# EAGLE design undercarriage (EAGLE 9.6.2)
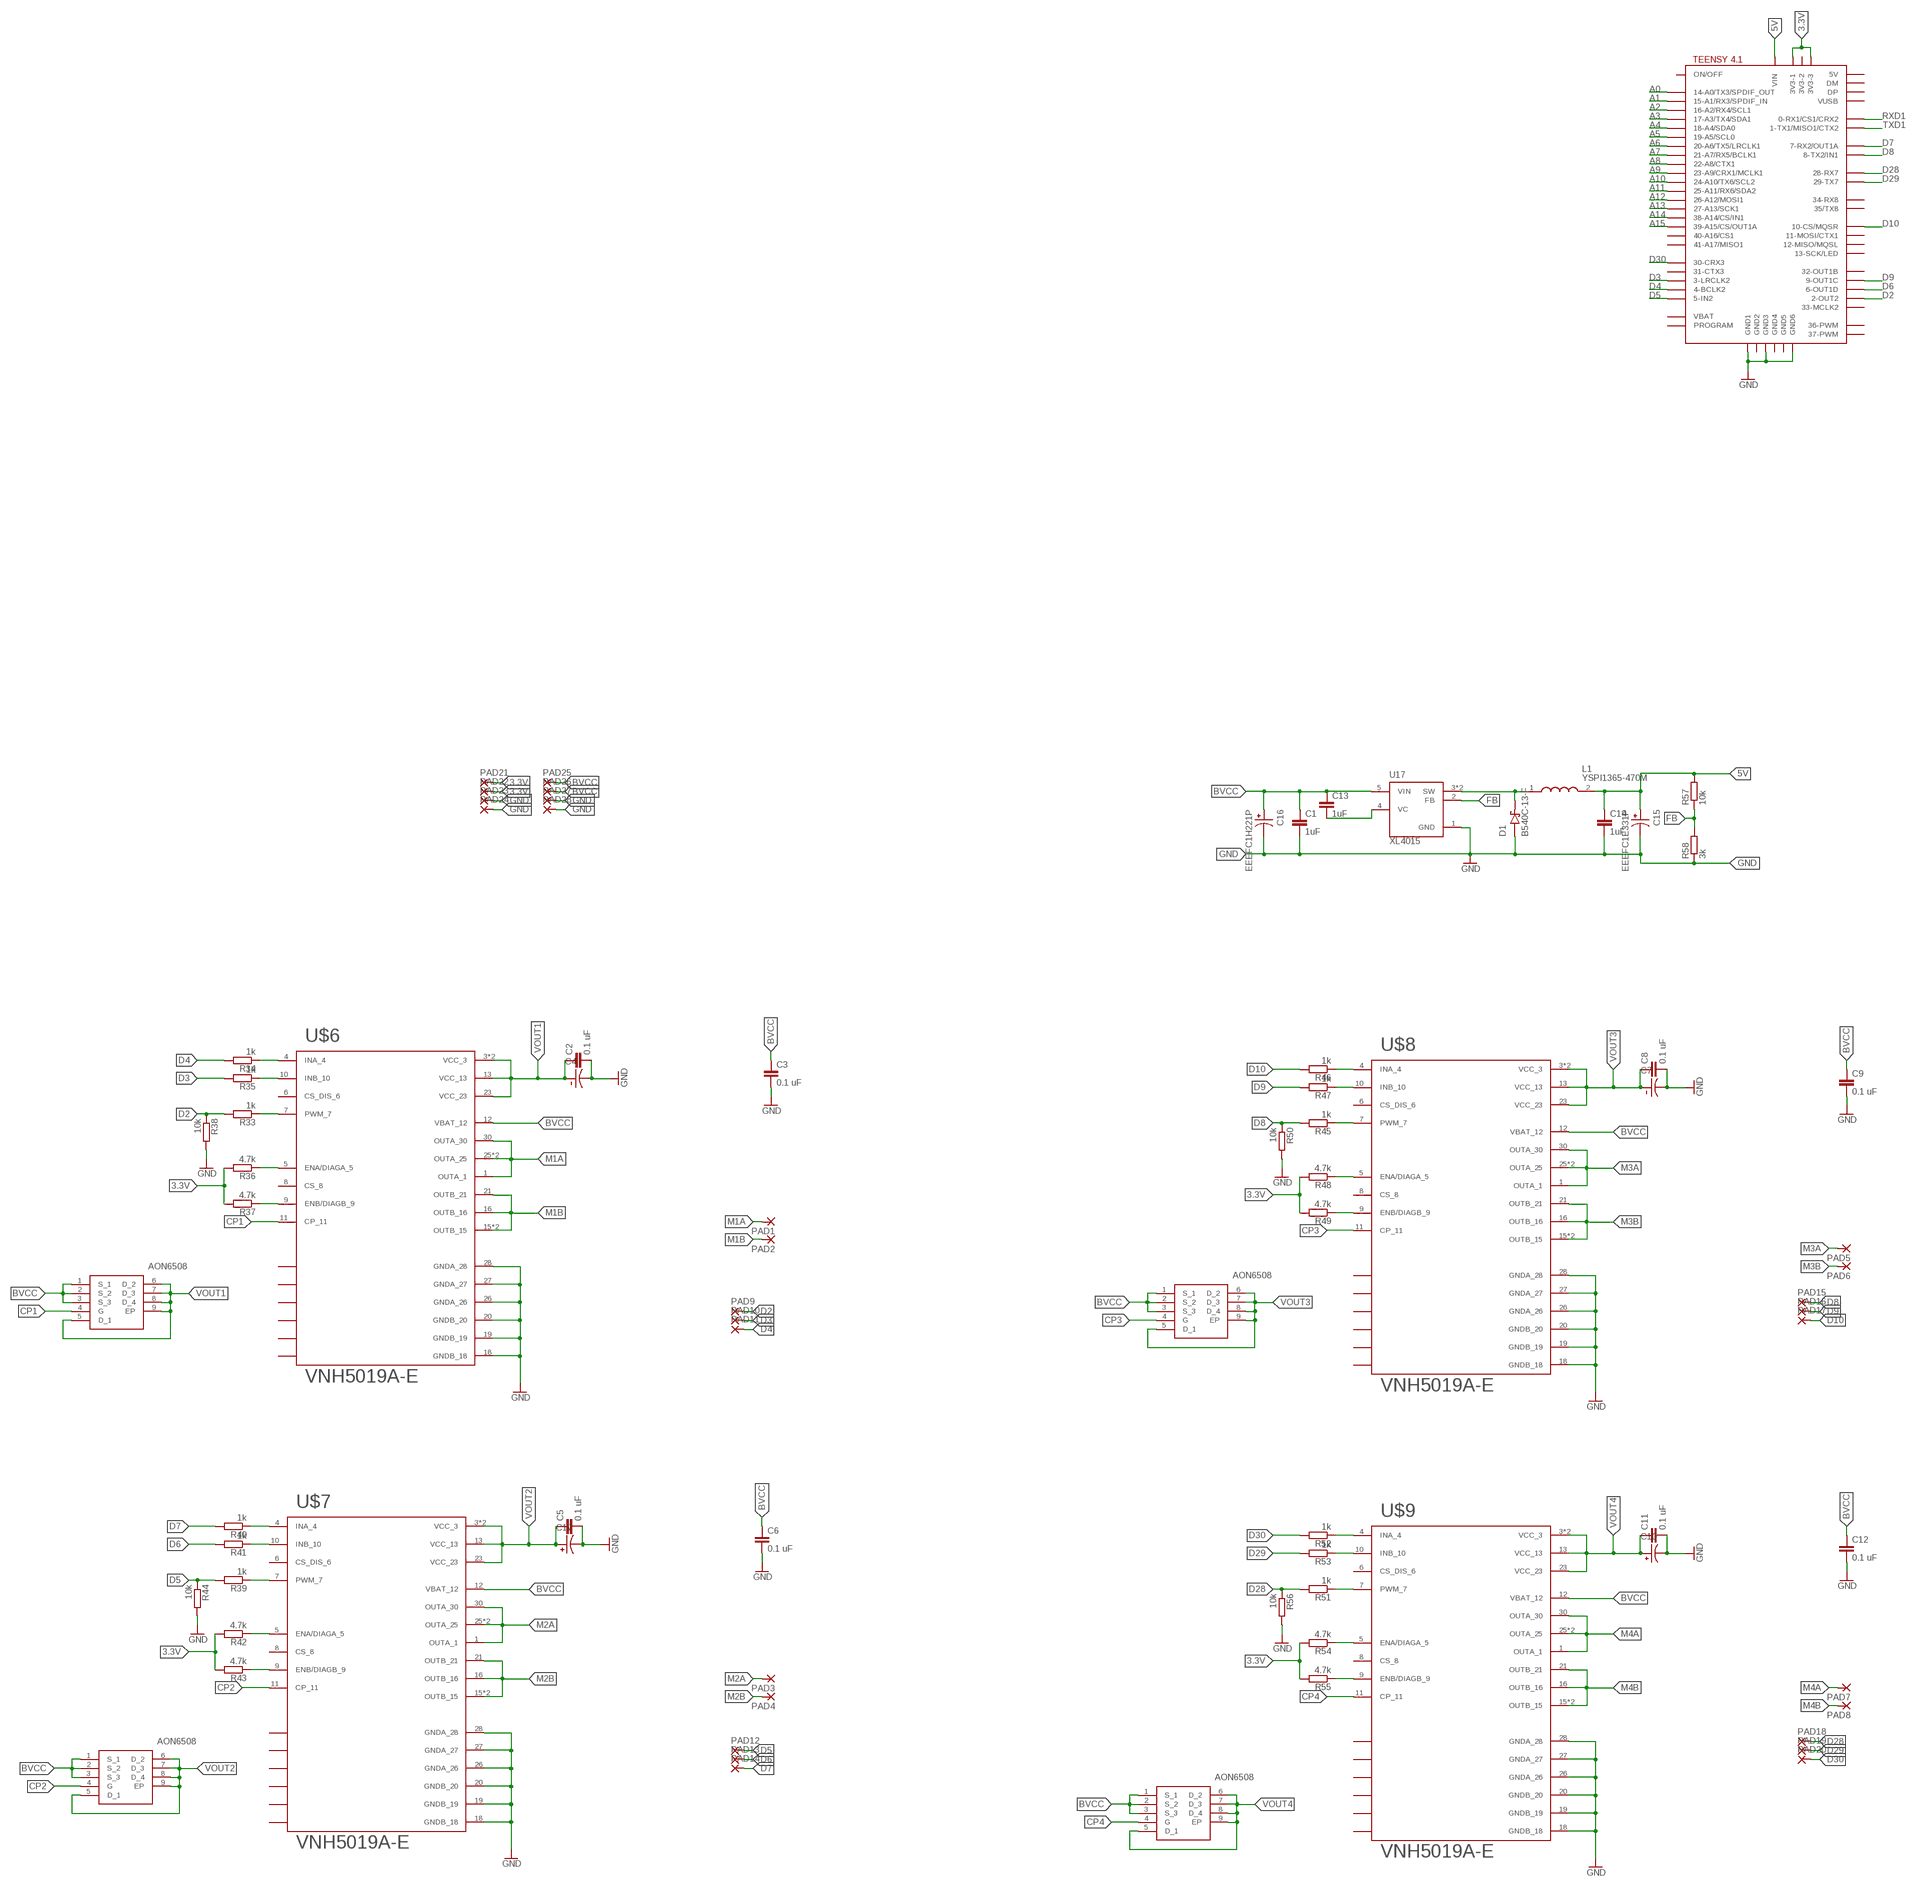
[diagram p0: schematic, sheet 1, part 1 of 2]
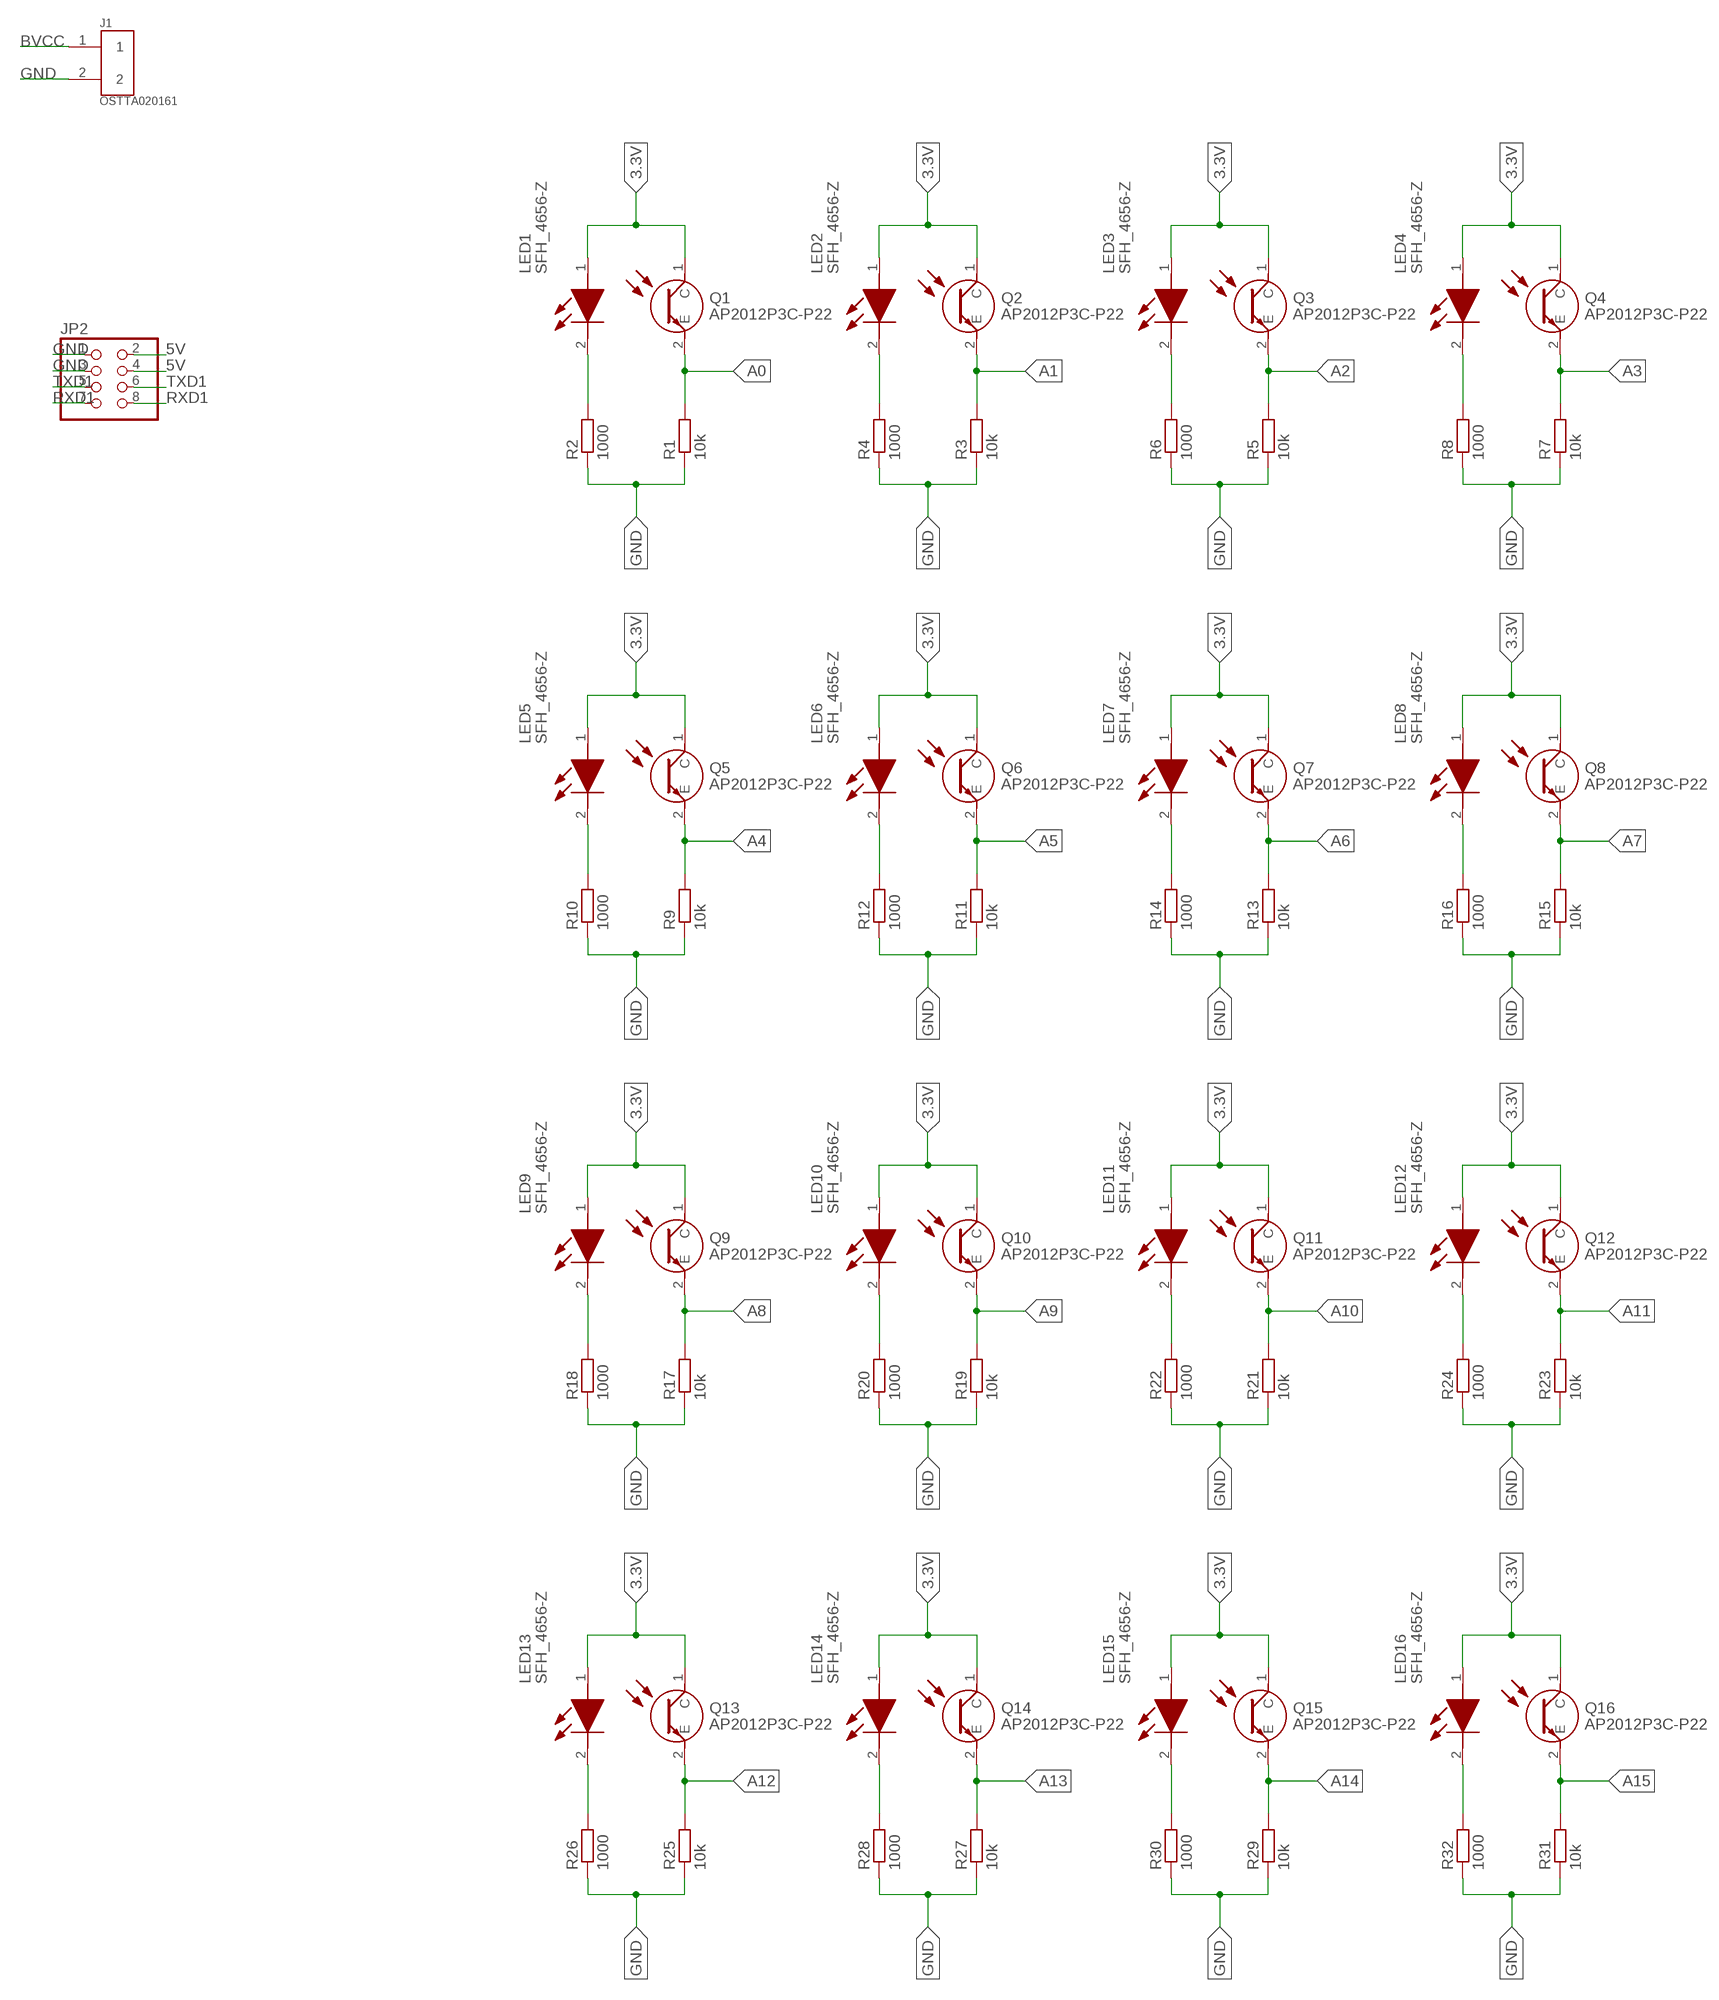
[diagram p1: schematic, sheet 1, part 2 of 2]

## Parts
C1  1uF  C-EUC0603  [C0603]
C2  0.1 uF  C-EUC0603  [C0603]
C3  0.1 uF  C-EUC0603  [C0603]
C4  EEEFT1H470AP  [CAP_EEEFT1H470AP]
C5  0.1 uF  C-EUC0603  [C0603]
C6  0.1 uF  C-EUC0603  [C0603]
C7  EEEFT1H470AP  [CAP_EEEFT1H470AP]
C8  0.1 uF  C-EUC0603  [C0603]
C9  0.1 uF  C-EUC0603  [C0603]
C10  EEEFT1H470AP  [CAP_EEEFT1H470AP]
C11  0.1 uF  C-EUC0603  [C0603]
C12  0.1 uF  C-EUC0603  [C0603]
C13  1uF  C-EUC0603  [C0603]
C14  1uF  C-EUC0603  [C0603]
C15  EEEFC1E331P  [CAP_EEEFC1E331P]
C16  EEEFC1H221P  [CAP_EEEFC1H221P]
C17  EEEFT1H470AP  [CAP_EEEFT1H470AP]
D1  B540C-13-F  [DIOM6959X245N]
J1  OSTTA020161  [OST_OSTTA020161]
JP2  PINHD-2X4  [2X04]
L1  YSPI1365-470M  [INDPM138126X650N]
LED1  SFH_4656-Z  [SFH4656Z]
LED2  SFH_4656-Z  [SFH4656Z]
LED3  SFH_4656-Z  [SFH4656Z]
LED4  SFH_4656-Z  [SFH4656Z]
LED5  SFH_4656-Z  [SFH4656Z]
LED6  SFH_4656-Z  [SFH4656Z]
LED7  SFH_4656-Z  [SFH4656Z]
LED8  SFH_4656-Z  [SFH4656Z]
LED9  SFH_4656-Z  [SFH4656Z]
LED10  SFH_4656-Z  [SFH4656Z]
LED11  SFH_4656-Z  [SFH4656Z]
LED12  SFH_4656-Z  [SFH4656Z]
LED13  SFH_4656-Z  [SFH4656Z]
LED14  SFH_4656-Z  [SFH4656Z]
LED15  SFH_4656-Z  [SFH4656Z]
LED16  SFH_4656-Z  [SFH4656Z]
PAD1  3,81/1,4  [3,81/1,4]
PAD2  3,81/1,4  [3,81/1,4]
PAD3  3,81/1,4  [3,81/1,4]
PAD4  3,81/1,4  [3,81/1,4]
PAD5  3,81/1,4  [3,81/1,4]
PAD6  3,81/1,4  [3,81/1,4]
PAD7  3,81/1,4  [3,81/1,4]
PAD8  3,81/1,4  [3,81/1,4]
PAD9  1,6/0,9  [1,6/0,9]
PAD10  1,6/0,9  [1,6/0,9]
PAD11  1,6/0,9  [1,6/0,9]
PAD12  1,6/0,9  [1,6/0,9]
PAD13  1,6/0,9  [1,6/0,9]
PAD14  1,6/0,9  [1,6/0,9]
PAD15  1,6/0,9  [1,6/0,9]
PAD16  1,6/0,9  [1,6/0,9]
PAD17  1,6/0,9  [1,6/0,9]
PAD18  1,6/0,9  [1,6/0,9]
PAD19  1,6/0,9  [1,6/0,9]
PAD20  1,6/0,9  [1,6/0,9]
PAD21  1,6/0,9  [1,6/0,9]
PAD22  1,6/0,9  [1,6/0,9]
PAD23  1,6/0,9  [1,6/0,9]
PAD24  1,6/0,9  [1,6/0,9]
PAD25  2,15/1,0  [2,15/1,0]
PAD26  2,15/1,0  [2,15/1,0]
PAD27  2,15/1,0  [2,15/1,0]
PAD28  2,15/1,0  [2,15/1,0]
Q1  AP2012P3C-P22  [AP2012P3CP22]
Q2  AP2012P3C-P22  [AP2012P3CP22]
Q3  AP2012P3C-P22  [AP2012P3CP22]
Q4  AP2012P3C-P22  [AP2012P3CP22]
Q5  AP2012P3C-P22  [AP2012P3CP22]
Q6  AP2012P3C-P22  [AP2012P3CP22]
Q7  AP2012P3C-P22  [AP2012P3CP22]
Q8  AP2012P3C-P22  [AP2012P3CP22]
Q9  AP2012P3C-P22  [AP2012P3CP22]
Q10  AP2012P3C-P22  [AP2012P3CP22]
Q11  AP2012P3C-P22  [AP2012P3CP22]
Q12  AP2012P3C-P22  [AP2012P3CP22]
Q13  AP2012P3C-P22  [AP2012P3CP22]
Q14  AP2012P3C-P22  [AP2012P3CP22]
Q15  AP2012P3C-P22  [AP2012P3CP22]
Q16  AP2012P3C-P22  [AP2012P3CP22]
Q17  AON6508  [AON6508]
Q18  AON6508  [AON6508]
Q19  AON6508  [AON6508]
Q20  AON6508  [AON6508]
R1  10k  R-EU_R0603  [R0603]
R2  1000  R-EU_R0603  [R0603]
R3  10k  R-EU_R0603  [R0603]
R4  1000  R-EU_R0603  [R0603]
R5  10k  R-EU_R0603  [R0603]
R6  1000  R-EU_R0603  [R0603]
R7  10k  R-EU_R0603  [R0603]
R8  1000  R-EU_R0603  [R0603]
R9  10k  R-EU_R0603  [R0603]
R10  1000  R-EU_R0603  [R0603]
R11  10k  R-EU_R0603  [R0603]
R12  1000  R-EU_R0603  [R0603]
R13  10k  R-EU_R0603  [R0603]
R14  1000  R-EU_R0603  [R0603]
R15  10k  R-EU_R0603  [R0603]
R16  1000  R-EU_R0603  [R0603]
R17  10k  R-EU_R0603  [R0603]
R18  1000  R-EU_R0603  [R0603]
R19  10k  R-EU_R0603  [R0603]
R20  1000  R-EU_R0603  [R0603]
R21  10k  R-EU_R0603  [R0603]
R22  1000  R-EU_R0603  [R0603]
R23  10k  R-EU_R0603  [R0603]
R24  1000  R-EU_R0603  [R0603]
R25  10k  R-EU_R0603  [R0603]
R26  1000  R-EU_R0603  [R0603]
R27  10k  R-EU_R0603  [R0603]
R28  1000  R-EU_R0603  [R0603]
R29  10k  R-EU_R0603  [R0603]
R30  1000  R-EU_R0603  [R0603]
R31  10k  R-EU_R0603  [R0603]
R32  1000  R-EU_R0603  [R0603]
R33  1k  R-EU_R0603  [R0603]
R34  1k  R-EU_R0603  [R0603]
R35  1k  R-EU_R0603  [R0603]
R36  4.7k  R-EU_R0603  [R0603]
R37  4.7k  R-EU_R0603  [R0603]
R38  10k  R-EU_R0603  [R0603]
R39  1k  R-EU_R0603  [R0603]
R40  1k  R-EU_R0603  [R0603]
R41  1k  R-EU_R0603  [R0603]
R42  4.7k  R-EU_R0603  [R0603]
R43  4.7k  R-EU_R0603  [R0603]
R44  10k  R-EU_R0603  [R0603]
R45  1k  R-EU_R0603  [R0603]
R46  1k  R-EU_R0603  [R0603]
R47  1k  R-EU_R0603  [R0603]
R48  4.7k  R-EU_R0603  [R0603]
R49  4.7k  R-EU_R0603  [R0603]
R50  10k  R-EU_R0603  [R0603]
R51  1k  R-EU_R0603  [R0603]
R52  1k  R-EU_R0603  [R0603]
R53  1k  R-EU_R0603  [R0603]
R54  4.7k  R-EU_R0603  [R0603]
R55  4.7k  R-EU_R0603  [R0603]
R56  10k  R-EU_R0603  [R0603]
R57  10k  R-EU_R0603  [R0603]
R58  3k  R-EU_R0603  [R0603]
U17  XL4015  [CONV_XL4015]
U$5  TEENSY41-E  [TENNSY41-E]
U$6  VNH5019A-E  [IC_MULTIPOWERSO-30TR]
U$7  VNH5019A-E  [IC_MULTIPOWERSO-30TR]
U$8  VNH5019A-E  [IC_MULTIPOWERSO-30TR]
U$9  VNH5019A-E  [IC_MULTIPOWERSO-30TR]

## Nets
3.3V: LED1.1(A) LED2.1(A) LED3.1(A) LED4.1(A) LED5.1(A) LED6.1(A) LED7.1(A) LED8.1(A) LED9.1(A) LED10.1(A) LED11.1(A) LED12.1(A) LED13.1(A) LED14.1(A) LED15.1(A) LED16.1(A) PAD21.1(P) PAD22.1(P) Q1.1(C) Q2.1(C) Q3.1(C) Q4.1(C) Q5.1(C) Q6.1(C) Q7.1(C) Q8.1(C) Q9.1(C) Q10.1(C) Q11.1(C) Q12.1(C) Q13.1(C) Q14.1(C) Q15.1(C) Q16.1(C) R36.2 R37.2 R42.2 R43.2 R48.2 R49.2 R54.2 R55.2 U$5.3V3-1 U$5.3V3-3
5V: C14.1 C15.1 JP2.2 JP2.4 L1.2 R57.2 U$5.VIN
A0: Q1.2(E) R1.2 U$5.14-A0/TX3/SPDIF_OUT
A1: Q2.2(E) R3.2 U$5.15-A1/RX3/SPDIF_IN
A2: Q3.2(E) R5.2 U$5.16-A2/RX4/SCL1
A3: Q4.2(E) R7.2 U$5.17-A3/TX4/SDA1
A4: Q5.2(E) R9.2 U$5.18-A4/SDA0
A5: Q6.2(E) R11.2 U$5.19-A5/SCL0
A6: Q7.2(E) R13.2 U$5.20-A6/TX5/LRCLK1
A7: Q8.2(E) R15.2 U$5.21-A7/RX5/BCLK1
A8: Q9.2(E) R17.2 U$5.22-A8/CTX1
A9: Q10.2(E) R19.2 U$5.23-A9/CRX1/MCLK1
A10: Q11.2(E) R21.2 U$5.24-A10/TX6/SCL2
A11: Q12.2(E) R23.2 U$5.25-A11/RX6/SDA2
A12: Q13.2(E) R25.2 U$5.26-A12/MOSI1
A13: Q14.2(E) R27.2 U$5.27-A13/SCK1
A14: Q15.2(E) R29.2 U$5.38-A14/CS/IN1
A15: Q16.2(E) R31.2 U$5.39-A15/CS/OUT1A
BVCC: C1.1 C3.1 C6.1 C9.1 C12.1 C13.1 C16.1 J1.1 PAD25.1(P) PAD26.1(P) Q17.1(S_1) Q17.2(S_2) Q17.3(S_3) Q18.1(S_1) Q18.2(S_2) Q18.3(S_3) Q19.1(S_1) Q19.2(S_2) Q19.3(S_3) Q20.1(S_1) Q20.2(S_2) Q20.3(S_3) U17.5(VIN) U$6.12(VBAT_12) U$7.12(VBAT_12) U$8.12(VBAT_12) U$9.12(VBAT_12)
CP1: Q17.4(G) U$6.11(CP_11)
CP2: Q18.4(G) U$7.11(CP_11)
CP3: Q20.4(G) U$8.11(CP_11)
CP4: Q19.4(G) U$9.11(CP_11)
D2: PAD9.1(P) R33.2 R38.1 U$5.2-OUT2
D3: PAD10.1(P) R35.2 U$5.3-LRCLK2
D4: PAD11.1(P) R34.2 U$5.4-BCLK2
D5: PAD12.1(P) R39.2 R44.1 U$5.5-IN2
D6: PAD13.1(P) R41.2 U$5.6-OUT1D
D7: PAD14.1(P) R40.2 U$5.7-RX2/OUT1A
D8: PAD15.1(P) R45.2 R50.1 U$5.8-TX2/IN1
D9: PAD16.1(P) R47.2 U$5.9-OUT1C
D10: PAD17.1(P) R46.2 U$5.10-CS\MQSR(10-CS/MQSR)
D28: PAD18.1(P) R51.2 R56.1 U$5.28-RX7
D29: PAD19.1(P) R53.2 U$5.29-TX7
D30: PAD20.1(P) R52.2 U$5.30-CRX3
FB: R57.1 R58.2 U17.2(FB)
GND: C1.2 C2.2 C3.2 C4.2 C5.2 C6.2 C7.2 C8.2 C9.2 C10.2 C11.2 C12.2 C14.2 C15.2 C16.2 C17.2 D1.A J1.2 JP2.1 JP2.3 PAD23.1(P) PAD24.1(P) PAD27.1(P) PAD28.1(P) R1.1 R2.1 R3.1 R4.1 R5.1 R6.1 R7.1 R8.1 R9.1 R10.1 R11.1 R12.1 R13.1 R14.1 R15.1 R16.1 R17.1 R18.1 R19.1 R20.1 R21.1 R22.1 R23.1 R24.1 R25.1 R26.1 R27.1 R28.1 R29.1 R30.1 R31.1 R32.1 R38.2 R44.2 R50.2 R56.2 R58.1 U17.1(GND) U$5.GND1 U$5.GND3 U$5.GND6 U$6.18(GNDB_18) U$6.19(GNDB_19) U$6.20(GNDB_20) U$6.26(GNDA_26) U$6.27(GNDA_27) U$6.28(GNDA_28) U$7.18(GNDB_18) U$7.19(GNDB_19) U$7.20(GNDB_20) U$7.26(GNDA_26) U$7.27(GNDA_27) U$7.28(GNDA_28) U$8.18(GNDB_18) U$8.19(GNDB_19) U$8.20(GNDB_20) U$8.26(GNDA_26) U$8.27(GNDA_27) U$8.28(GNDA_28) U$9.18(GNDB_18) U$9.19(GNDB_19) U$9.20(GNDB_20) U$9.26(GNDA_26) U$9.27(GNDA_27) U$9.28(GNDA_28)
M1A: PAD1.1(P) U$6.1(OUTA_1) U$6.25(OUTA_25) U$6.30(OUTA_30) U$6.HS2(OUTA_25)
M1B: PAD2.1(P) U$6.15(OUTB_15) U$6.16(OUTB_16) U$6.21(OUTB_21) U$6.HS3(OUTB_15)
M2A: PAD3.1(P) U$7.1(OUTA_1) U$7.25(OUTA_25) U$7.30(OUTA_30) U$7.HS2(OUTA_25)
M2B: PAD4.1(P) U$7.15(OUTB_15) U$7.16(OUTB_16) U$7.21(OUTB_21) U$7.HS3(OUTB_15)
M3A: PAD5.1(P) U$8.1(OUTA_1) U$8.25(OUTA_25) U$8.30(OUTA_30) U$8.HS2(OUTA_25)
M3B: PAD6.1(P) U$8.15(OUTB_15) U$8.16(OUTB_16) U$8.21(OUTB_21) U$8.HS3(OUTB_15)
M4A: PAD7.1(P) U$9.1(OUTA_1) U$9.25(OUTA_25) U$9.30(OUTA_30) U$9.HS2(OUTA_25)
M4B: PAD8.1(P) U$9.15(OUTB_15) U$9.16(OUTB_16) U$9.21(OUTB_21) U$9.HS3(OUTB_15)
N$1: LED2.2(K) R4.2
N$2: LED3.2(K) R6.2
N$3: LED1.2(K) R2.2
N$4: LED4.2(K) R8.2
N$5: R33.1 U$6.7(PWM_7)
N$6: R34.1 U$6.4(INA_4)
N$7: C13.2 U17.4(VC)
N$8: R35.1 U$6.10(INB_10)
N$9: LED5.2(K) R10.2
N$10: LED6.2(K) R12.2
N$11: R37.1 U$6.9(ENB/DIAGB_9)
N$12: R36.1 U$6.5(ENA/DIAGA_5)
N$14: R39.1 U$7.7(PWM_7)
N$15: R40.1 U$7.4(INA_4)
N$16: R41.1 U$7.10(INB_10)
N$17: R43.1 U$7.9(ENB/DIAGB_9)
N$18: LED7.2(K) R14.2
N$19: LED8.2(K) R16.2
N$20: LED9.2(K) R18.2
N$21: LED10.2(K) R20.2
N$22: LED11.2(K) R22.2
N$23: LED12.2(K) R24.2
N$24: LED13.2(K) R26.2
N$25: LED14.2(K) R28.2
N$26: LED15.2(K) R30.2
N$27: LED16.2(K) R32.2
N$28: R42.1 U$7.5(ENA/DIAGA_5)
N$30: R45.1 U$8.7(PWM_7)
N$31: R46.1 U$8.4(INA_4)
N$32: R47.1 U$8.10(INB_10)
N$33: R49.1 U$8.9(ENB/DIAGB_9)
N$34: R48.1 U$8.5(ENA/DIAGA_5)
N$36: R51.1 U$9.7(PWM_7)
N$37: R52.1 U$9.4(INA_4)
N$38: R53.1 U$9.10(INB_10)
N$39: R55.1 U$9.9(ENB/DIAGB_9)
N$40: R54.1 U$9.5(ENA/DIAGA_5)
N$42: D1.C(K) L1.1 U17.3(SW) U17.3.1(SW)
RXD1: JP2.7 JP2.8 U$5.0-RX1/CS1/CRX2
TXD1: JP2.5 JP2.6 U$5.1-TX1/MISO1/CTX2
VOUT1: C2.1 C4.1 Q17.5(D_1) Q17.6(D_2) Q17.7(D_3) Q17.8(D_4) Q17.9(EP) U$6.3(VCC_3) U$6.13(VCC_13) U$6.23(VCC_23) U$6.HS1(VCC_3)
VOUT2: C5.1 C17.1 Q18.5(D_1) Q18.6(D_2) Q18.7(D_3) Q18.8(D_4) Q18.9(EP) U$7.3(VCC_3) U$7.13(VCC_13) U$7.23(VCC_23) U$7.HS1(VCC_3)
VOUT3: C7.1 C8.1 Q20.5(D_1) Q20.6(D_2) Q20.7(D_3) Q20.8(D_4) Q20.9(EP) U$8.3(VCC_3) U$8.13(VCC_13) U$8.23(VCC_23) U$8.HS1(VCC_3)
VOUT4: C10.1 C11.1 Q19.5(D_1) Q19.6(D_2) Q19.7(D_3) Q19.8(D_4) Q19.9(EP) U$9.3(VCC_3) U$9.13(VCC_13) U$9.23(VCC_23) U$9.HS1(VCC_3)
Unconnected: U$5.3V3-2 U$5.11-MOSI/CTX1 U$5.12-MISO/MQSL U$5.13-SCK/LED U$5.31-CTX3 U$5.32-OUT1B U$5.33-MCLK2 U$5.34-RX8 U$5.35-TX8(35/TX8) U$5.36-PWM U$5.37-PWM U$5.40-A16/CS1 U$5.41-A17/MISO1 U$5.+5V(5V) U$5.DM U$5.DP U$5.GND2 U$5.GND4 U$5.GND5 U$5.ON/OFF U$5.PROGRAM U$5.VBAT U$5.VUSB U$6.2(N.C._2) U$6.6(CS_DIS_6) U$6.8(CS_8) U$6.14(NC_14) U$6.17(NC_17) U$6.22(NC_22) U$6.24(NC_24) U$6.29(N.C._29) U$7.2(N.C._2) U$7.6(CS_DIS_6) U$7.8(CS_8) U$7.14(NC_14) U$7.17(NC_17) U$7.22(NC_22) U$7.24(NC_24) U$7.29(N.C._29) U$8.2(N.C._2) U$8.6(CS_DIS_6) U$8.8(CS_8) U$8.14(NC_14) U$8.17(NC_17) U$8.22(NC_22) U$8.24(NC_24) U$8.29(N.C._29) U$9.2(N.C._2) U$9.6(CS_DIS_6) U$9.8(CS_8) U$9.14(NC_14) U$9.17(NC_17) U$9.22(NC_22) U$9.24(NC_24) U$9.29(N.C._29)

## Library data of the parts
C1-C3 C5 C6 C8 C9 C11-C14 = rcl:C-EU: CAPACITOR, European symbol; SPICEPREFIX: C
C4 C7 C10 C17 = EEEFT1H470AP:EEEFT1H470AP: Check availability <https://pricing.snapeda.com/parts/EEEFT1H470AP/Panasonic/view-part?ref=eda>; AVAILABILITY: In Stock; DESCRIPTION: 47µF 50V Aluminum Electrolytic Capacitors Radial, Can - SMD 680mOhm @ 100kHz 2000 Hrs @ 105°C; MF: Panasonic; MP: EEEFT1H470AP; PACKAGE: RADIAL-2 Panasonic; PRICE: None
C15 = EEEFC1E331P:EEEFC1E331P: Check availability <https://pricing.snapeda.com/parts/EEEFC1E331P/Panasonic/view-part?ref=eda>; AVAILABILITY: Not in stock; DESCRIPTION: Cap Aluminum Lytic 330uF 25V 20% (10 X 10.2mm) SMD 670mA 1000h 105°C Automotive T/R; MF: Panasonic; MP: EEEFC1E331P; PACKAGE: RADIAL-2 Panasonic; PRICE: None
C16 = EEEFC1H221P:EEEFC1H221P: Check availability <https://pricing.snapeda.com/parts/EEEFC1H221P/Panasonic/view-part?ref=eda>; AVAILABILITY: Not in stock; DESCRIPTION: 220µF 50V Aluminum Electrolytic Capacitors Radial, Can - SMD 1000 Hrs @ 105°C; MF: Panasonic; MP: EEEFC1H221P; PACKAGE: RADIAL-2 Panasonic; PRICE: None
D1 = B540C-13-F:B540C-13-F: Diode, Schottky, 5a, 40v, Do-214ab-2, Full Reel Check availability <https://pricing.snapeda.com/parts/B540C-13-F/Diodes%20Inc./view-part?ref=eda>; AVAILABILITY: In Stock; DESCRIPTION: Diode Schottky 40 V 5A Surface Mount SMC; MF: Diodes Inc.; MP: B540C-13-F; PACKAGE: DO-214 Diodes Inc.; PRICE: None; PURCHASE-URL: https://pricing.snapeda.com/search/part/B540C-13-F/?ref=eda
J1 = OSTTA020161:OSTTA020161: Connector Terminal Blocks 2 Position 5mm Solder Straight Thru-Hole 16A Check availability <https://pricing.snapeda.com/parts/OSTTA020161/On%20Shore/view-part?ref=eda>; AVAILABILITY: In Stock; DESCRIPTION: 2 Position Wire to Board Terminal Block Horizontal with Board 0.197 (5.00mm) Through Hole; MF: On Shore; MP: OSTTA020161; PACKAGE: None; PRICE: None; PURCHASE-URL: https://pricing.snapeda.com/search/part/OSTTA020161/?ref=eda
JP2 = pinhead:PINHD-2X4: PIN HEADER
L1 = YSPI1365-470M:YSPI1365-470M: YSPI1365-470M Source: Datasheet <https://datasheet.lcsc.com/lcsc/2003172239_YJYCOIN-YSPI1365-470M_C497913.pdf>; DESCRIPTION: YSPI1365-470M; HEIGHT: 6.5mm; MANUFACTURER_NAME: YJYCOIN; MANUFACTURER_PART_NUMBER: YSPI1365-470M
LED1-LED16 = SFH_4656-Z:SFH_4656-Z: Infrared Emitters - High Power 850 nm MIDLED Source: Datasheet <https://dammedia.osram.info/media/resource/hires/osram-dam-16623498/SFH 4656_CN.pdf>; DESCRIPTION: Infrared Emitters - High Power 850 nm MIDLED; HEIGHT: 1.7mm; MANUFACTURER_NAME: OSRAM; MANUFACTURER_PART_NUMBER: SFH 4656-Z; MOUSER_PART_NUMBER: 720-SFH4656-Z; MOUSER_PRICE-STOCK: http://www.mouser.com/Search/ProductDetail.aspx?qs=KeLXQb9Uup2X3iF4LUEobw%3d%3d
PAD1-PAD8 = wirepad:3,81/1,4: THROUGH-HOLE PAD
PAD9-PAD24 = wirepad:1,6/0,9: THROUGH-HOLE PAD
PAD25-PAD28 = wirepad:2,15/1,0: THROUGH-HOLE PAD
Q1-Q16 = AP2012P3C-P22:AP2012P3C-P22: Phototransistors 2x1.2mm PHOTOTRANS SMD LED Source: Datasheet <http://www.kingbrightusa.com/images/catalog/SPEC/AP2012P3C-P22.pdf>; ARROW_PART_NUMBER: AP2012P3C-P22; ARROW_PRICE-STOCK: https://www.arrow.com/en/products/ap2012p3c-p22/kingbright; DESCRIPTION: Phototransistors 2x1.2mm PHOTOTRANS SMD LED; HEIGHT: 1.1mm; MANUFACTURER_NAME: Kingbright; MANUFACTURER_PART_NUMBER: AP2012P3C-P22; MOUSER_PART_NUMBER: 604-AP2012P3C-P22; MOUSER_PRICE-STOCK: https://www.mouser.com/Search/Refine.aspx?Keyword=604-AP2012P3C-P22
Q17-Q20 = AON6508:AON6508: Trans MOSFET N-CH 30V 32A 8-Pin DFN EP T/R Source: Datasheet <https://datasheet.lcsc.com/szlcsc/1910101232_Alpha-Omega-Semicon-AOS-AON6508_C431189.pdf>; ARROW_PART_NUMBER: AON6508; ARROW_PRICE-STOCK: https://www.arrow.com/en/products/aon6508/alpha-and-omega-semiconductor; DESCRIPTION: Trans MOSFET N-CH 30V 32A 8-Pin DFN EP T/R; HEIGHT: 1mm; MANUFACTURER_NAME: Alpha & Omega Semiconductors; MANUFACTURER_PART_NUMBER: AON6508
R1-R58 = rcl:R-EU_: RESISTOR, European symbol; SPICEPREFIX: R
U17 = XL4015:XL4015: 5A 180KHz 36V Buck DC to DC Converter Check availability <https://pricing.snapeda.com/parts/XL4015/XLSEMI/view-part?ref=eda>; AVAILABILITY: Not in stock; DESCRIPTION: 5A 180KHz 36V Buck DC to DC Converter; MF: XLSEMI; MP: XL4015; PACKAGE: None; PRICE: None
U$5 = teensy:TEENSY41-E
U$6-U$9 = VNH5019A-E:VNH5019A-E: Automotive fully integrated H-bridge motor driver Description: The VHN5019A-E is a full bridge motor driver intended for a wide range of automotive applications. The device incorporates a dual monolithic high-side drivers and two low-side switches. The high-side driver switch is designed using STMicroelectronics’ well known and proven proprietary VIPower® M0 technology that allows to efficiently integrate on the same die a true Power MOSFET with an intelligent signal/protection circuit. Features : AEC-Q100 qualified ECOPACK®: lead free and RoHS compliant Output current: 30 A 3 V CMOS compatible inputs Undervoltage and overvoltage shutdown High-side and low-side thermal shutdown Cross-conduction protection Current limitation Very low standby power consumption PWM operation up to 20 kHz Protection against: Loss of ground and loss of VCC Current sense output proportional to motor current Charge pump output for reverse polarity protection Output protected against short to ground and short to VCC Check availability <https://pricing.snapeda.com/parts/VNH5019A-E/STMicroelectronics/view-part?ref=eda>; AVAILABILITY: In Stock; DESCRIPTION: - Motor Driver Power MOSFET Parallel, PWM MultiPowerSO-30; MF: STMicroelectronics; MP: VNH5019A-E; PACKAGE: PowerSOP-30 STMicroelectronics; PRICE: None; PURCHASE-URL: https://pricing.snapeda.com/search/part/VNH5019A-E/?ref=eda

## Board
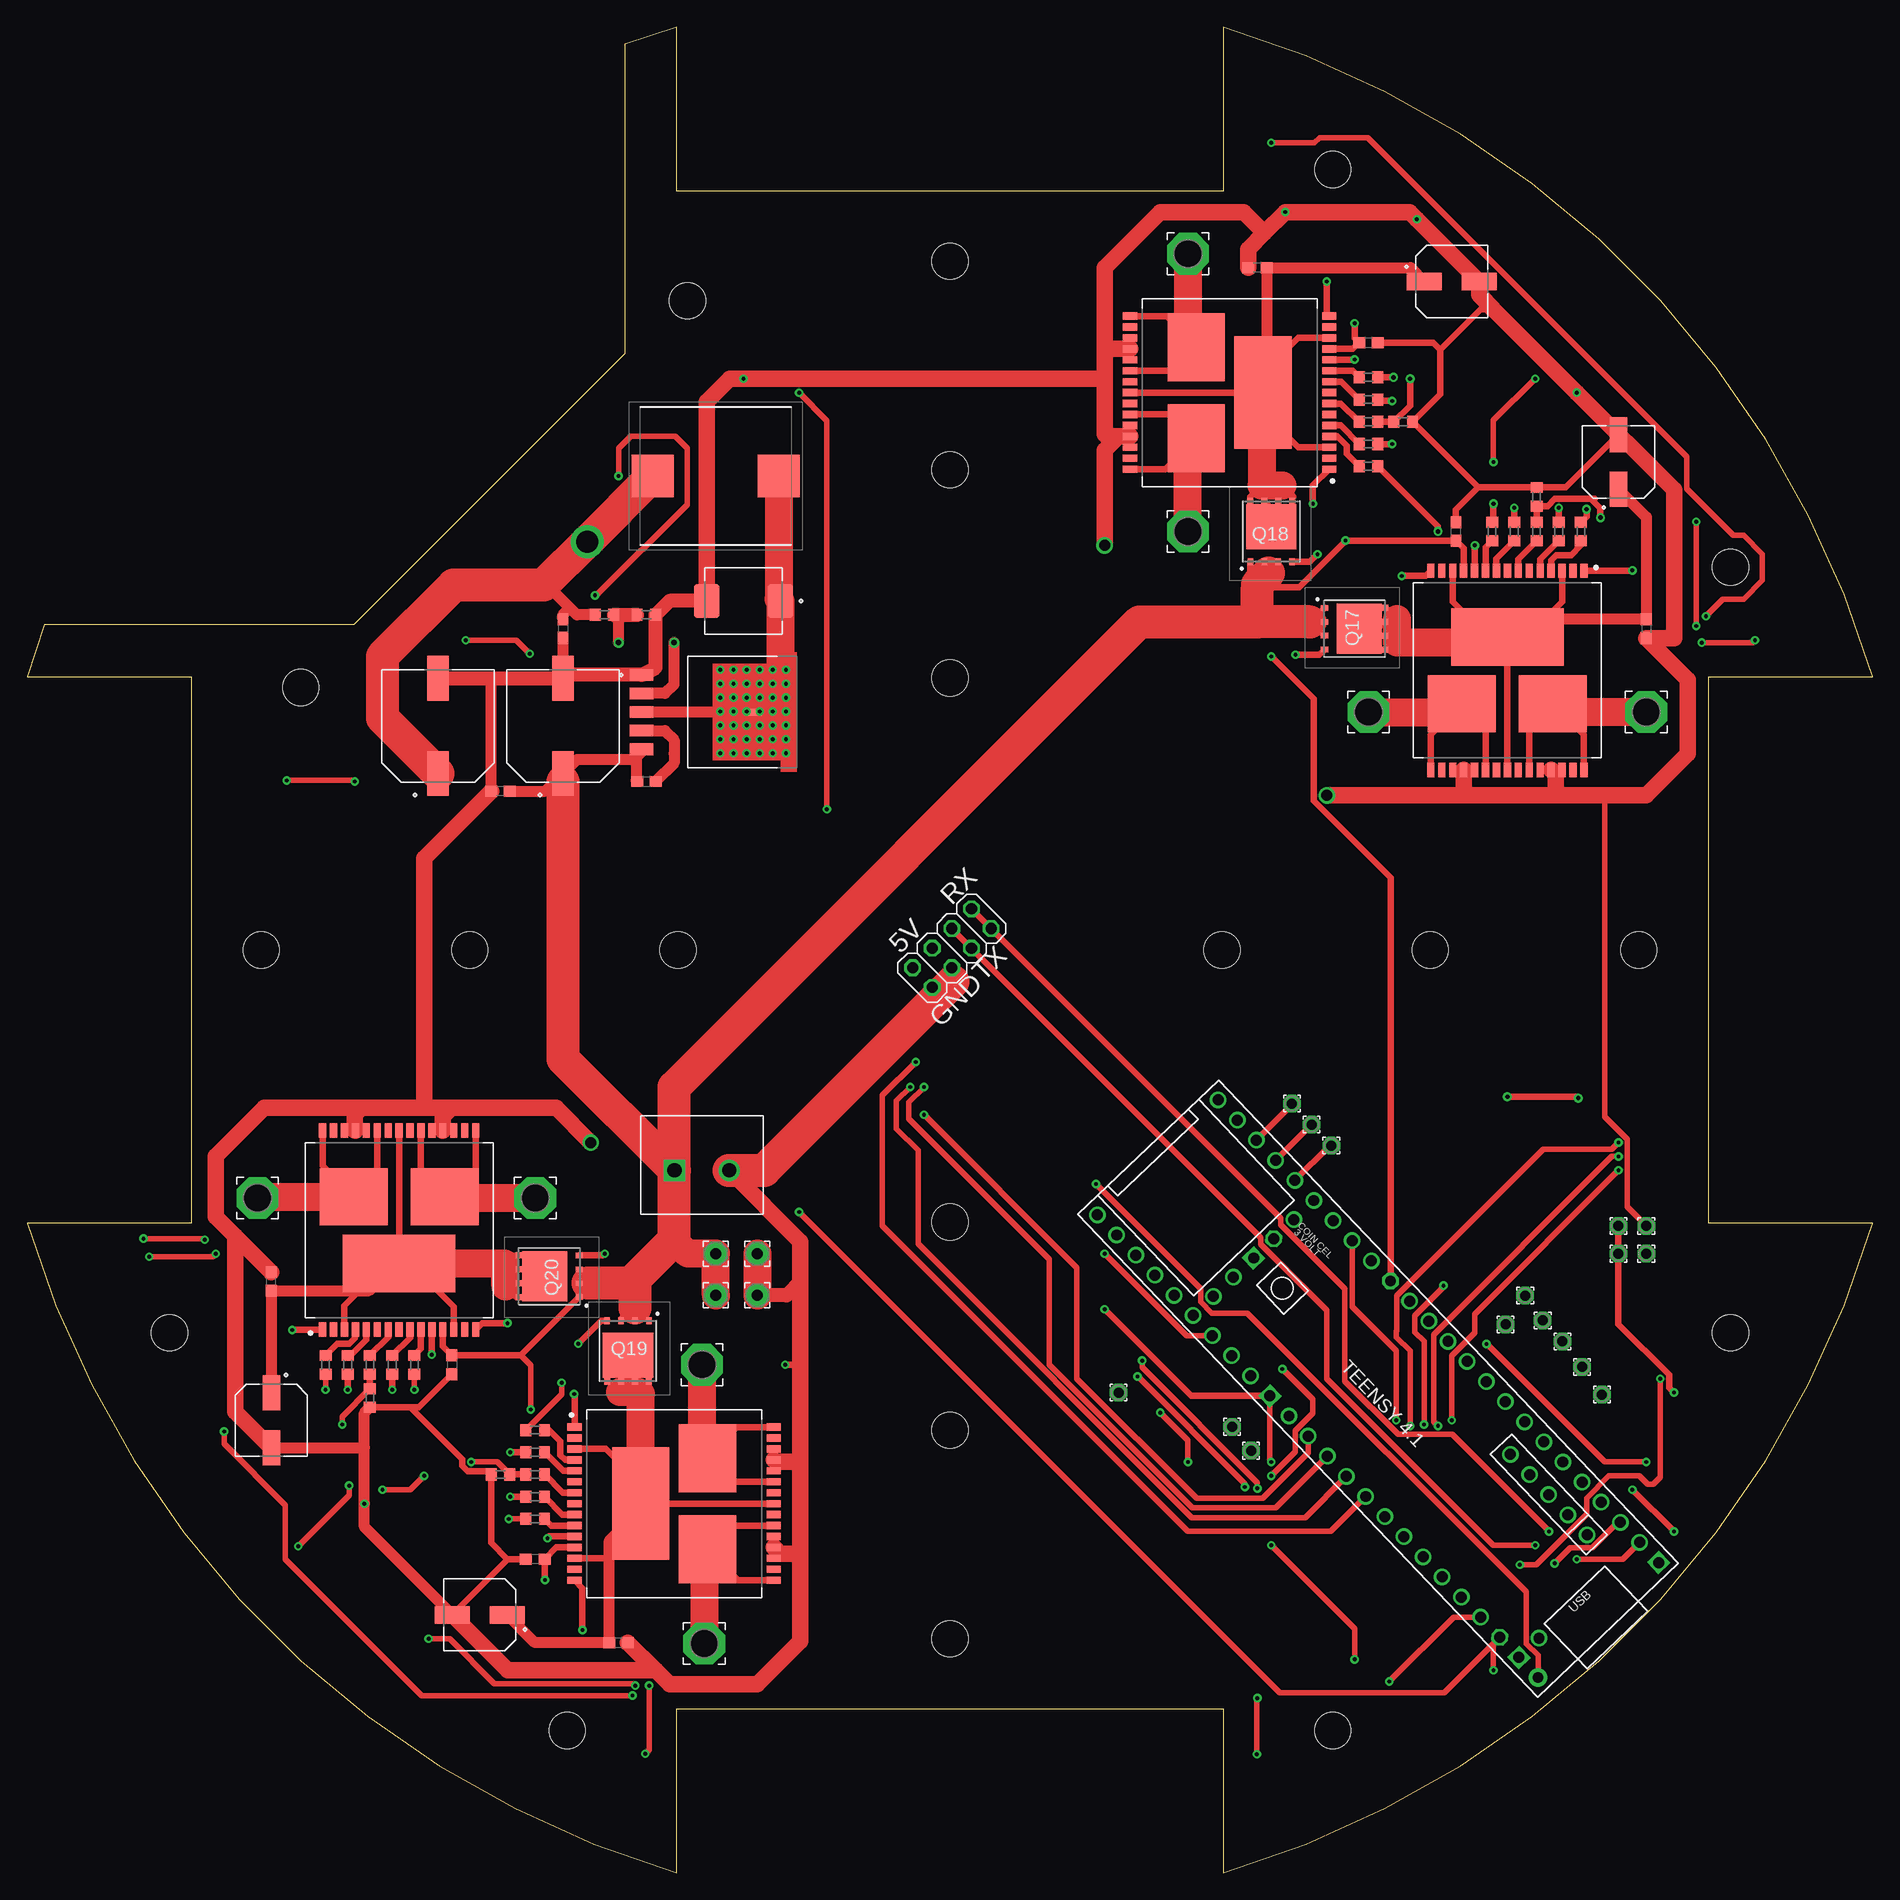
[diagram p2: board, top side]
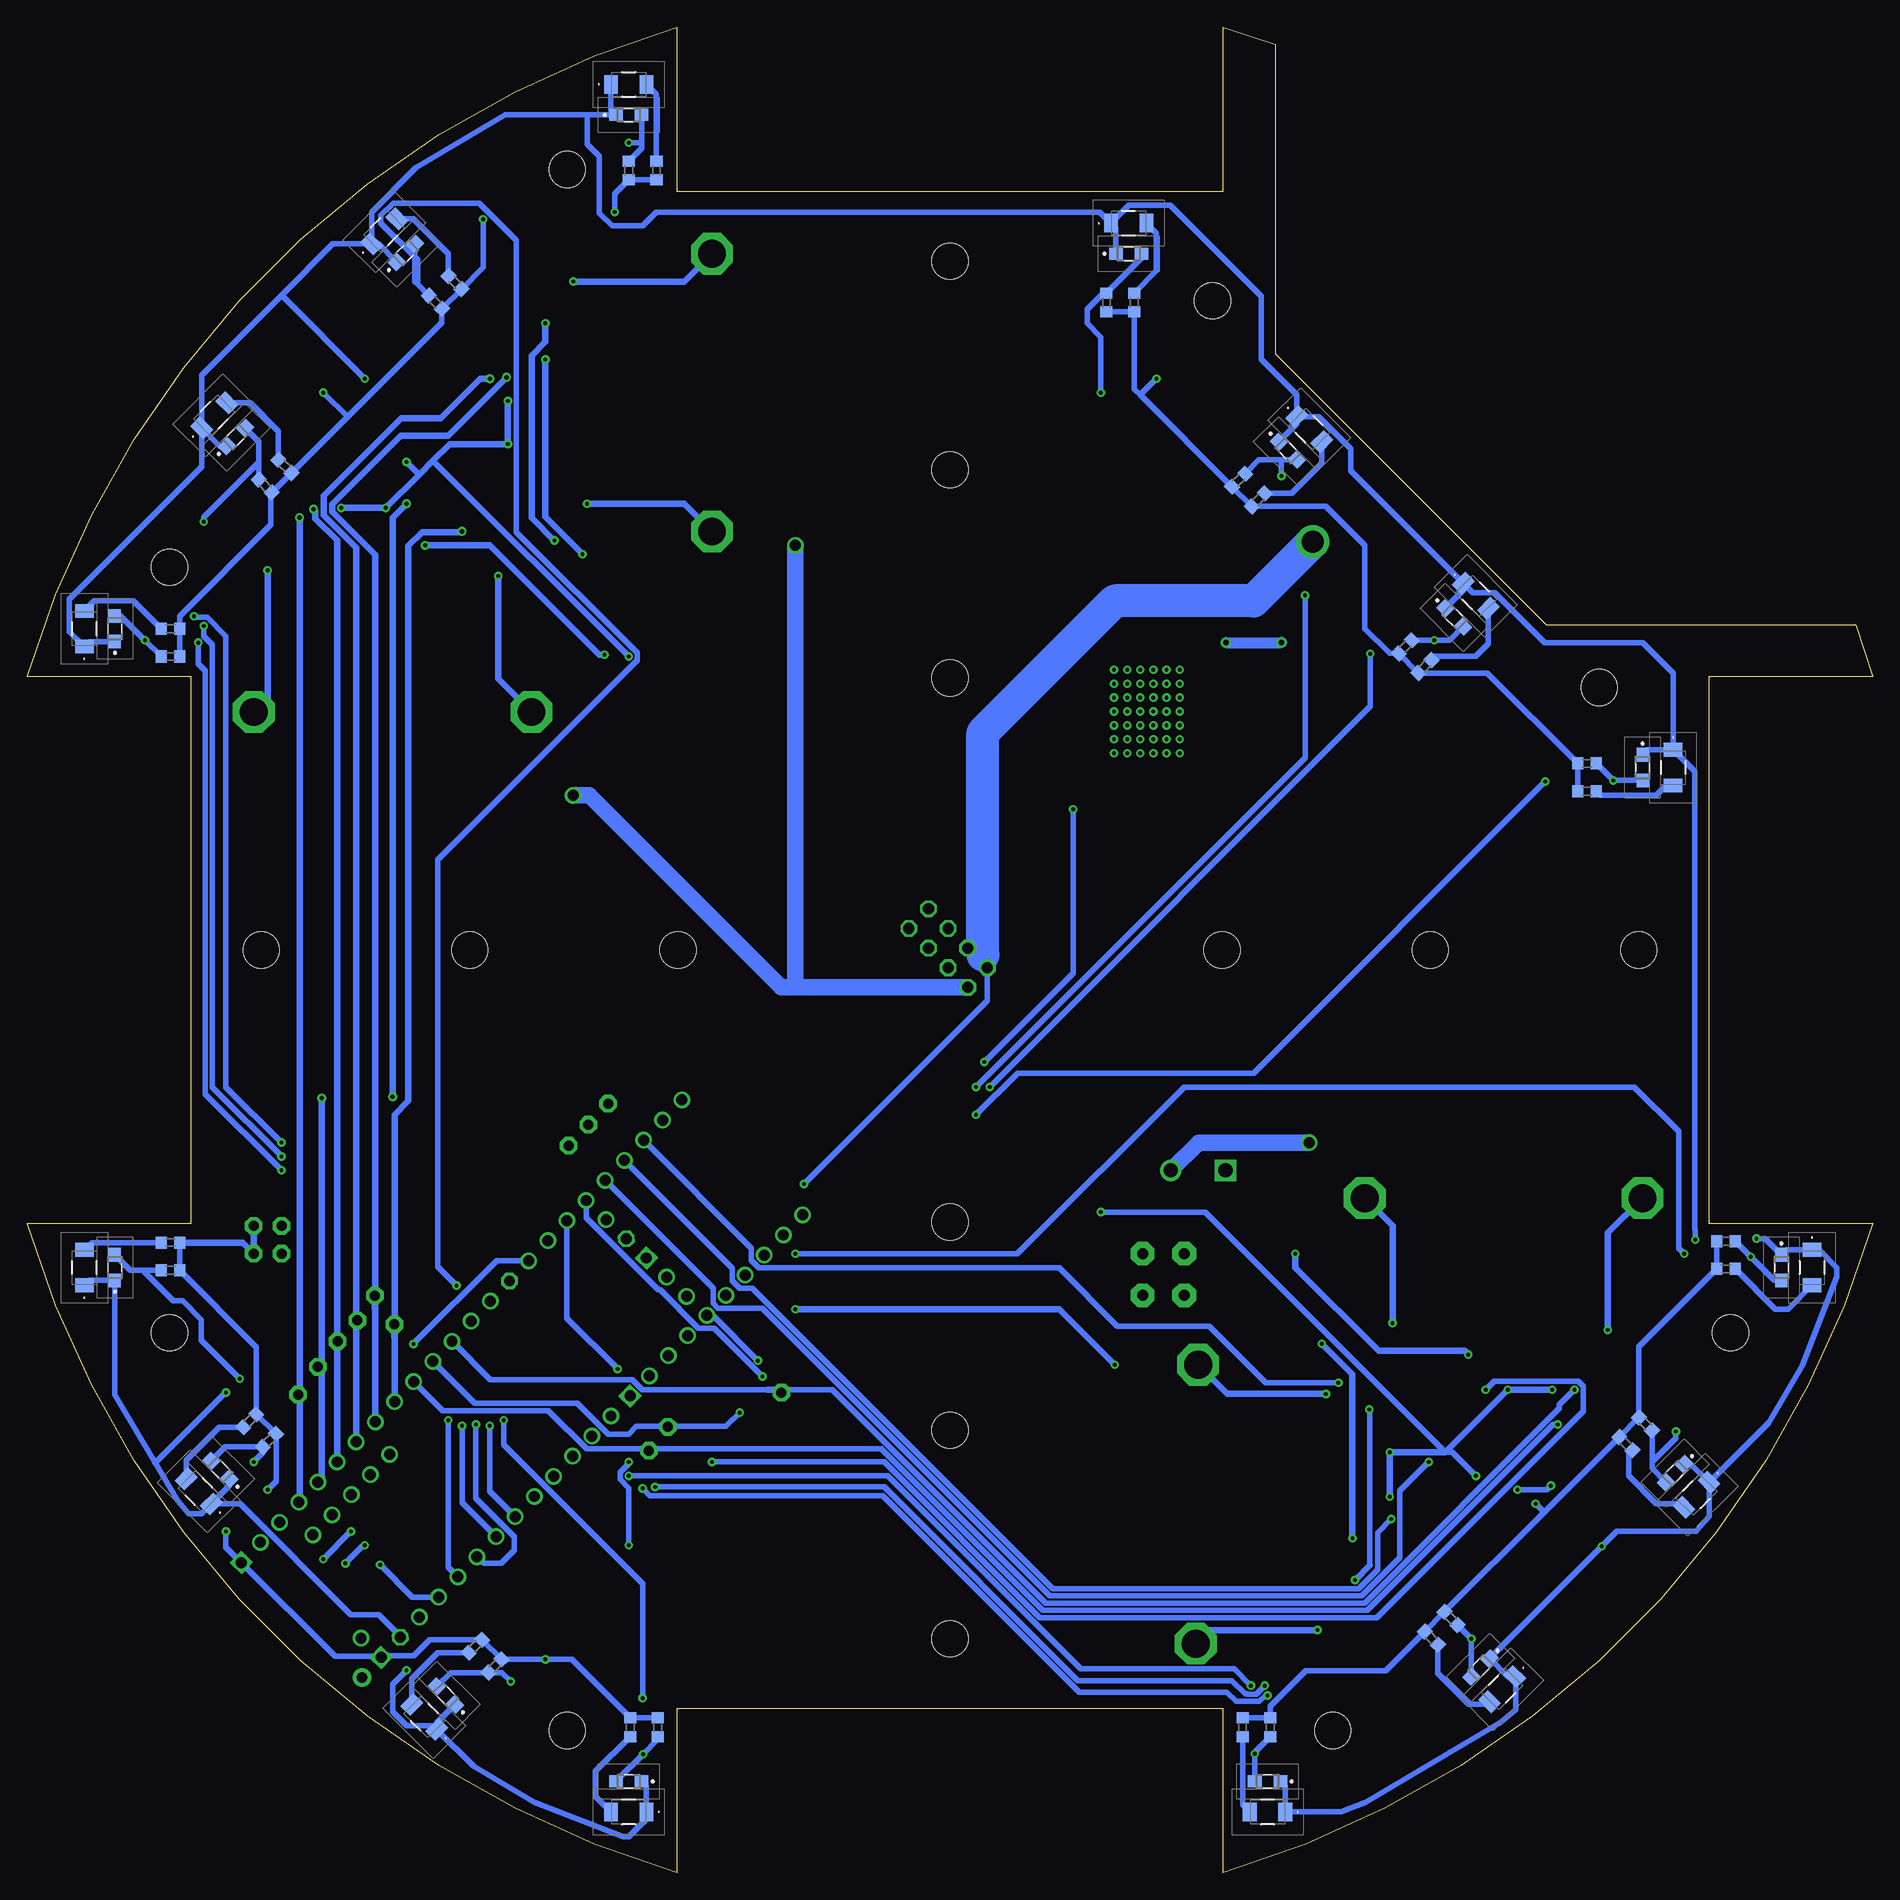
[diagram p3: board, bottom side, seen from below]

Size 168.75 x 168.75 mm. Coordinates in mm from the lower left corner, seen from the top.
Outline: 0,109.37 15,109.37 15,59.37 0,59.37 arc57 59.37,0 59.37,15 109.37,15 109.37,0 arc57 168.75,59.37 153.75,59.37 153.75,109.37 168.75,109.37 arc57 109.37,168.75 109.37,153.75 59.37,153.75 59.37,168.75 54.62,167.19 54.62,138.91 29.84,114.13 1.56,114.13 0,109.37
Copper layers (1*16): Top 0.035mm / dielectric 1.5mm / Bottom 0.035mm
Design rules "default": minimum track width 6mil, minimum drill 0.35mm, track to track 6mil, track to pad 6mil, pad to pad 6mil, via to via 6mil, smd to smd 6mil, copper to edge 40mil, drill to drill 6mil, minimum pad ring 10mil, minimum via ring 8mil, stop-mask expansion 4mil, vias tented up to drill 0mil, thermal gap 10mil
Holes 3.3 mm at 13,49.37 40.45,84.37 60.37,143.75 84.37,147.35 84.37,109.25 147.35,84.37 109.25,84.37 119.37,155.75 155.75,119.37 119.37,13 59.5,84.37 49.37,13 84.37,21.4 155.75,49.37 84.37,59.5 128.3,84.37 84.37,128.3 25,108.37 21.4,84.37 84.37,40.45

### Footprints (pad centres in the part's own frame; a part is rotated, then mirrored left to right if it is on the bottom)
C0603 = smd 1.1 x 1: 1 -0.85,0; 2 0.85,0
CAP_EEEFT1H470AP = smd 3.2 x 1.6: 1 -2.5,0; 2 2.5,0
CAP_EEEFC1E331P = smd 4.1 x 2: 1 -4.35,0; 2 4.35,0
CAP_EEEFC1H221P = smd 4.1 x 2: 1 -4.35,0; 2 4.35,0
DIOM6959X245N = smd 2.33 x 3.07: A 3.365,0; C -3.365,0
OST_OSTTA020161 = drill 1.3 square: 1 -2.5,0 | drill 1.3: 2 2.5,0
2X04 = drill 1.016 octagon: 1 -3.81,-1.27; 2 -3.81,1.27; 3 -1.27,-1.27; 4 -1.27,1.27; 5 1.27,-1.27; 6 1.27,1.27; 7 3.81,-1.27; 8 3.81,1.27
INDPM138126X650N = smd 3.85 x 3.9: 1 -5.75,0; 2 5.75,0
SFH4656Z = smd 1.25 x 1.7: 1 -1.625,0; 2 1.625,0
3,81/1,4 = drill 2.54 pad 3.81 octagon: 1 0,0
1,6/0,9 = drill 0.914 pad 1.6 octagon: 1 0,0
2,15/1,0 = drill 1.016 pad 2.159 octagon: 1 0,0
AP2012P3CP22 = smd 1.25 x 1.1: 1 -1.175,0; 2 1.175,0
AON6508 = smd 0.5 x 0.65: 1 -1.905,-2.75; 2 -0.635,-2.75; 3 0.635,-2.75; 4 1.905,-2.75 | smd 0.55 x 0.65: 5 1.905,2.75; 6 0.635,2.75; 7 -0.635,2.75; 8 -1.905,2.75 | smd 4.6 x 4.12: 9 0,0.415
R0603 = smd 1 x 1.1: 1 -0.85,0; 2 0.85,0
CONV_XL4015 = smd 2.16 x 1.07: 1 -4.747,3.4; 2 -4.747,1.7; 3 -4.747,0; 4 -4.747,-1.7; 5 -4.747,-3.4 | smd 1.27 x 0.635: 3.1 5.588,0
TENNSY41-E = drill 1: 0-RX1/CS1/CRX2 -27.94,-7.62; 1-TX1/MISO1/CTX2 -25.4,-7.62; 2-OUT2 -22.86,-7.62; 3-LRCLK2 -20.32,-7.62; 4-BCLK2 -17.78,-7.62; 5-IN2 -15.24,-7.62; 6-OUT1D -12.7,-7.62; 7-RX2/OUT1A -10.16,-7.62; 8-TX2/IN1 -7.62,-7.62; 9-OUT1C -5.08,-7.62; 10-CS\MQSR -2.54,-7.62; 11-MOSI/CTX1 0,-7.62; 12-MISO/MQSL 2.54,-7.62; 13-SCK/LED 2.54,7.62; 14-A0/TX3/SPDIF_OUT 0,7.62; 15-A1/RX3/SPDIF_IN -2.54,7.62; 16-A2/RX4/SCL1 -5.08,7.62; 17-A3/TX4/SDA1 -7.62,7.62; 18-A4/SDA0 -10.16,7.62; 19-A5/SCL0 -12.7,7.62; 20-A6/TX5/LRCLK1 -15.24,7.62; 21-A7/RX5/BCLK1 -17.78,7.62; 22-A8/CTX1 -20.32,7.62; 23-A9/CRX1/MCLK1 -22.86,7.62; 24-A10/TX6/SCL2 7.62,-7.62; 25-A11/RX6/SDA2 10.16,-7.62; 26-A12/MOSI1 12.7,-7.62; 27-A13/SCK1 15.24,-7.62; 28-RX7 17.78,-7.62; 29-TX7 20.32,-7.62; 30-CRX3 22.86,-7.62; 31-CTX3 25.4,-7.62; 32-OUT1B 27.94,-7.62; 33-MCLK2 27.94,7.62; 34-RX8 25.4,7.62; 35-TX8 22.86,7.62; 36-PWM 20.32,7.62; 37-PWM 17.78,7.62; 38-A14/CS/IN1 15.24,7.62; 39-A15/CS/OUT1A 12.7,7.62; 40-A16/CS1 10.16,7.62; 41-A17/MISO1 7.62,7.62; +5V -24.13,-4.62; DM -21.59,-4.62; DP -19.05,-4.62; GND4 -16.51,-4.62; GND5 -13.97,-4.62; ON/OFF 15.24,5.08; PROGRAM 15.24,2.54; VBAT 15.24,-5.08; VUSB -27.94,5.08 | drill 1 octagon: 3V3-1 5.08,-7.62; 3V3-2 15.24,-2.54; 3V3-3 -25.4,7.62 | drill 1 square: GND1 -30.48,-7.62; GND2 15.24,0; GND3 5.08,7.62; GND6 -27.94,7.62 | drill 1 pad 1.676: VIN -30.48,7.62
IC_MULTIPOWERSO-30TR = smd 1.3 x 0.665: 1 -9.1,7; 2 -9.1,6; 3 -9.1,5; 4 -9.1,4; 5 -9.1,3; 6 -9.1,2; 7 -9.1,1; 8 -9.1,0; 9 -9.1,-1; 10 -9.1,-2; 11 -9.1,-3; 12 -9.1,-4; 13 -9.1,-5; 14 -9.1,-6; 15 -9.1,-7; 16 9.1,-7; 17 9.1,-6; 18 9.1,-5; 19 9.1,-4; 20 9.1,-3; 21 9.1,-2; 22 9.1,-1; 23 9.1,0; 24 9.1,1; 25 9.1,2; 26 9.1,3; 27 9.1,4; 28 9.1,5; 29 9.1,6; 30 9.1,7 | smd 5.25 x 10.3: HS1 -3.05,0 | smd 5.25 x 6.23: HS2 3.05,4.165; HS3 3.05,-4.165

### Placement (x,y rotation side)
C1  43.27,98.9 180 top
C2  148.04,113.75 270 top
C3  130.65,122.64 90 top
C4  145.5,128.99 90 top
C5  112.48,146.77 180 top
C6  122.64,139.92 0 top
C7  22.31,41.36 270 top
C8  22.31,54.06 90 top
C9  46.44,28.66 180 top
C10  41.36,23.58 180 top
C11  54.06,21.04 0 top
C12  38.82,46.44 270 top
C13  56.6,99.78 0 top
C14  48.98,113.75 270 top
C15  37.55,104.86 90 top
C16  48.98,104.86 90 top
C17  130.26,145.5 0 top
D1  65.49,116.29 180 top
J1  61.68,64.22 0 top
JP2  84.54,84.54 45 top
L1  62.95,127.72 180 top
LED1  18.25,101.05 270 bottom
LED2  51.52,132 315 bottom
LED3  36.28,116.76 315 bottom
LED4  68.03,150.84 0 bottom
LED5  113.75,163.54 0 bottom
LED6  151.66,133.27 45 bottom
LED7  136.11,150.09 45 bottom
LED8  163.54,113.75 90 bottom
LED9  163.54,55.33 90 bottom
LED10  132.45,14.23 135 bottom
LED11  153.07,34.86 135 bottom
LED12  113.75,5.55 180 bottom
LED13  55.33,5.55 180 bottom
LED14  33.89,16.78 225 bottom
LED15  16.11,34.56 225 bottom
LED16  5.55,55.33 270 bottom
PAD1  148.04,106.13 0 top
PAD2  122.64,106.13 0 top
PAD3  106.13,122.64 0 top
PAD4  106.13,148.04 0 top
PAD5  21.04,61.68 0 top
PAD6  46.44,61.68 0 top
PAD7  61.68,46.44 0 top
PAD8  61.9,20.94 0 top
PAD9  143.99,43.71 0 top
PAD10  142.17,46.25 0 top
PAD11  140.37,48.57 0 top
PAD12  138.57,50.49 0 top
PAD13  136.97,52.77 0 top
PAD14  135.17,50.13 0 top
PAD15  111.9,38.58 0 top
PAD16  110.17,40.77 0 top
PAD17  99.78,43.9 0 top
PAD18  119.24,66.48 0 top
PAD19  117.44,68.4 0 top
PAD20  115.64,70.32 0 top
PAD21  145.5,59.14 0 top
PAD22  145.5,56.6 0 top
PAD23  148.04,59.14 0 top
PAD24  148.04,56.6 0 top
PAD25  62.95,52.79 0 top
PAD26  62.95,56.6 0 top
PAD27  66.76,56.6 0 top
PAD28  66.76,52.79 0 top
Q1  21.04,101.05 270 bottom
Q2  53.5,130.03 315 bottom
Q3  38.26,114.79 315 bottom
Q4  68.03,148.04 0 bottom
Q5  113.75,160.74 0 bottom
Q6  149.68,131.29 45 bottom
Q7  134.13,148.11 45 bottom
Q8  160.74,113.75 90 bottom
Q9  160.74,55.33 90 bottom
Q10  130.47,16.21 135 bottom
Q11  151.1,36.84 135 bottom
Q12  113.75,8.34 180 bottom
Q13  55.33,8.34 180 bottom
Q14  35.86,18.76 225 bottom
Q15  18.08,36.54 225 bottom
Q16  8.34,55.33 270 bottom
Q17  121.37,113.75 270 top
Q18  113.75,122.64 0 top
Q19  54.93,47.71 180 top
Q20  47.73,54.53 90 top
R1  26.12,101.44 0 bottom
R2  26.12,98.9 0 bottom
R3  57.99,127.33 45 bottom
R4  56.19,125.54 45 bottom
R5  42.75,112.09 45 bottom
R6  40.95,110.3 45 bottom
R7  70.07,143.6 90 bottom
R8  67.53,143.6 90 bottom
R9  113.75,155.66 90 bottom
R10  111.21,155.66 90 bottom
R11  146.99,126.8 135 bottom
R12  145.19,128.6 135 bottom
R13  131.44,143.62 135 bottom
R14  129.64,145.42 135 bottom
R15  155.66,111.21 180 bottom
R16  155.66,113.75 180 bottom
R17  155.66,55.08 180 bottom
R18  155.66,57.62 180 bottom
R19  125.98,18.9 225 bottom
R20  127.78,20.7 225 bottom
R21  146.61,39.53 225 bottom
R22  148.4,41.33 225 bottom
R23  111.09,13.3 270 bottom
R24  113.63,13.3 270 bottom
R25  55.08,13.3 270 bottom
R26  57.62,13.3 270 bottom
R27  38.56,23.25 315 bottom
R28  40.35,21.45 315 bottom
R29  20.78,41.03 315 bottom
R30  22.57,39.23 315 bottom
R31  13.42,57.75 0 bottom
R32  13.42,55.21 0 bottom
R33  138.01,122.64 90 top
R34  142.08,122.64 90 top
R35  133.95,122.64 90 top
R36  140.04,122.64 90 top
R37  135.98,122.64 90 top
R38  138.01,125.82 90 top
R39  122.64,132.68 0 top
R40  122.64,128.61 0 top
R41  122.64,136.74 0 top
R42  122.64,130.65 0 top
R43  122.64,134.71 0 top
R44  125.82,132.68 0 top
R45  31.33,46.44 270 top
R46  27.27,46.44 270 top
R47  35.4,46.44 270 top
R48  29.3,46.44 270 top
R49  33.36,46.44 270 top
R50  31.33,43.4 270 top
R51  46.44,36.41 180 top
R52  46.44,40.48 180 top
R53  46.44,32.35 180 top
R54  46.44,38.44 180 top
R55  46.44,34.38 180 top
R56  43.27,36.41 180 top
R57  52.79,115.02 180 top
R58  56.6,115.02 180 top
U17  60.92,106.13 0 top
U$5  122.64,45.17 133.6 top
U$6  135.34,109.94 270 top
U$7  109.94,135.34 180 top
U$8  34,58.76 90 top
U$9  59.14,33.74 0 top

### Tracks (layer width: path | path; a pad name or v marks a point on that pad's centre or on a via)
3.3V  (via drill 0.35)
  Top 0.508: v70.57,60.41 114.54,16.45 129.56,16.45 U$5.3V3-3 134.07,20.96 v134.07,18.5 | v36.28,36.28 35.01,35.01 v32.47,35.01 | v29.43,35.4 29.43,34.51 v24.77,29.85 | v134.07,128.99 134.07,132.8 v137.88,136.61 | v10.63,57.98 16.11,57.98 v16.22,57.87
  Top 0.61: R55.2 v44.16,34.38 | v44.16,38.44 R54.2 | R49.2 v33.36,44.16 | v29.3,44.16 R48.2 | R42.2 v124.8,130.65 | v124.8,134.58 123.62,134.58 R43.2 | R37.2 v135.98,124.8 | v140.04,124.8 R36.2 | U$5.3V3-1 124.66,90.98 117.63,98.01 117.63,107.34 v113.75,111.21 | v150.58,43.9 150.15,44.34 150.15,45.52 145.5,50.17 PAD22.1 PAD21.1
  Bottom 0.508: v70.57,60.41 61.05,60.41 39.08,38.44 38.44,38.44 v36.28,36.28 | Q13.1 53.71,7.89 LED13.1 48.6,5.55 46.35,6.42 34.01,13.77 32.66,14.91 32.66,17.85 LED14.1 33.37,17.93 Q14.1 v24.77,29.85 23.42,31.2 16.15,31.2 16.07,31.29 14.96,32.6 LED15.1 | LED15.1 16.62,37.37 Q15.1 | LED15.1 9.52,41.15 6.42,46.35 3.26,54.47 3.26,55.33 4.89,56.96 LED16.1 7.89,56.96 Q16.1 9.82,57.98 v10.63,57.98 | v32.47,35.01 29.81,35.01 v29.43,35.4 | Q12.1 112.13,7.89 LED12.1 112.13,4.89 113.75,3.26 114.28,3.26 122.4,6.42 127.92,9.71 LED10.1 | Q10.1 131.3,13.72 LED10.1 | LED10.1 131.64,13.42 134.07,13.42 135.34,14.69 135.34,17.23 v134.07,18.5 | LED11.1 149.28,33.71 139.15,23.58 136.61,23.58 134.64,21.61 U$5.3V3-3 | LED11.1 150.27,35.37 Q11.1 | LED9.1 163.09,54.16 Q9.1 160.74,43.69 157.05,37.49 154.98,34.01 153.98,32.83 152.81,32.83 LED11.1 | Q8.1 163.09,112.58 LED8.1 164.9,113.49 164.9,116.46 152.81,128.55 LED6.1 | Q6.1 151.15,130.46 LED6.1 | Q7.1 136.62,148.94 LED7.1 | LED6.1 152.81,136.93 145.5,144.23 | LED7.1 140.8,148.94 145.5,144.23 | LED7.1 137.26,151.85 133.21,155.89 125.05,160.74 117.56,160.74 | 117.56,160.74 Q5.1 115.38,161.19 LED5.1 | 132.93,127.85 v134.07,128.99 | v137.88,136.61 145.5,144.23 | LED4.1 69.21,150.39 Q4.1 | LED4.1 68.02,152.48 64.22,152.48 55.89,144.15 55.89,138.38 52.67,135.16 LED2.1 | Q2.1 52.67,132.52 LED2.1 | Q3.1 37.43,117.28 LED3.1 | LED3.1 47.71,128.2 47.71,130.2 50.66,133.15 LED2.1 | LED3.1 36.58,117.06 34.58,117.06 30,112.48 21.04,112.48 18.25,109.69 LED1.1 | LED1.1 20.59,102.68 Q1.1 | v16.22,57.87 16.22,58.8 16.27,58.85 16.27,100.7 LED1.1 | 117.56,160.74 117.56,158.07 116.45,156.96 116.45,151.76 115.28,150.58 112.48,150.58 111.21,151.85 70.68,151.85 LED4.1
  Bottom 0.61: v44.16,34.38 v44.16,38.44 39.08,38.44 v33.36,44.16 v29.3,44.16 | v124.8,134.58 v124.8,130.65 130.14,130.65 131.66,129.12 | v140.04,124.8 v135.98,124.8 132.93,127.85 131.66,129.12 | v113.75,111.21 131.66,129.12 | 157.05,37.49 150.63,43.9 v150.58,43.9
5V  (via drill 0.35, 2)
  Top 0.508: v97.73,62.97 107.28,53.41 107.28,52.22 108.33,51.18 111.56,51.18 137.06,25.68 137.06,20.95 138.15,19.87 U$5.VIN
  Top 1.016: R57.2 50.25,115.02 49.62,115.66 | 49.62,115.66 47.38,117.9 | C14.1 48.98,115.02 49.62,115.66
  Top 3: C15.1 32.47,105.59 32.47,111.21 38.99,117.73 47.21,117.73 47.38,117.9 v51.19,121.71 L1.2
  Bottom 0.508: JP2.4 82.11,83.91 81.37,83.91 80.95,83.49 JP2.2 80.95,79.75 v97.73,62.97
  Bottom 3: v51.19,121.71 56.6,116.29 69.3,116.29 81.37,104.23 81.37,83.91
A0  (via drill 0.35)
  Top 0.508: v23.72,99.88 29.84,99.88 v29.93,99.78 | U$5.14-A0/TX3/SPDIF_OUT 117.13,38.39 112.97,34.23 106.92,34.23 95.97,45.17 95.97,55.33 v82,69.3
  Bottom 0.508: Q1.2 v23.72,99.88 R1.2 | v29.93,99.78 56.6,73.11 78.19,73.11 v82,69.3
A1  (via drill 0.35)
  Top 0.508: U$5.15-A1/RX3/SPDIF_IN 114.16,33.36 106.52,33.36 93.43,46.44 93.43,56.1 80.61,68.92 80.61,70.45 v82,71.84 | v54.06,127.72 v54.07,127.73 54.07,130.24 55.18,131.35 59.23,131.35 60.34,130.24 60.34,125.11 52.03,116.8 v51.91,116.8
  Bottom 0.508: Q2.2 54.06,129.2 | 54.06,129.2 56.12,129.2 R3.2 | 54.06,129.2 v54.06,127.72 | v51.91,116.8 51.91,101.94 v82,71.84
A2  (via drill 0.35)
  Top 0.508: U$5.16-A2/RX4/SCL1 116.86,32.47 106.47,32.47 81.45,57.49 81.45,66.04 79.46,68.03 79.46,70.57 v80.73,71.84 | v40.09,112.7 44.71,112.7 v45.94,111.47
  Bottom 0.508: R5.2 v40.09,112.7 38.69,112.7 Q3.2 | v45.94,111.47 45.94,106.64 v80.73,71.84
A3  (via drill 0.35)
  Top 0.508: U$5.17-A3/TX4/SDA1 119.18,31.2 106.13,31.2 78.19,59.14 78.19,71.08 v81.24,74.13 | v73.11,97.24 73.11,132.79 v70.57,135.33
  Bottom 0.508: Q4.2 66.86,147.66 R7.2 70.36,144.45 71.84,142.96 71.84,141.69 70.57,140.42 v70.57,135.33 | v81.24,74.13 73.11,82.26 v73.11,97.24
A4  (via drill 0.35)
  Top 0.508: v113.75,158.2 117.7,158.2 118.16,158.67 122.58,158.67 151.74,129.5 151.74,126.57 156.01,122.29 156.96,122.29 158.67,120.58 158.67,118.16 156.96,116.45 155.06,116.45 v153.51,114.9 | v145.5,66.76 144.89,66.15 138.64,66.15 125.24,52.75 125.24,49.55 125.18,49.49 125.18,48.98 126.45,47.71 v126.45,40.86
  Bottom 0.508: Q5.2 112.58,158.2 | 112.58,158.2 112.58,157.69 R9.2 | 112.58,158.2 v113.75,158.2 | v153.51,114.9 153.4,114.79 152.29,114.79 150.58,113.09 150.58,71.84 v145.5,66.76 | v126.45,40.86 126.45,34.88 U$5.18-A4/SDA0
A5  (via drill 0.35)
  Top 0.508: v152.62,123.53 v152.62,114.01 | v128.99,40.86 128.62,41.24 128.62,49.2 144.91,65.49 v145.5,65.49
  Bottom 0.508: Q6.2 147.59,130.86 147.59,128.99 | 147.59,128.99 R11.2 | 147.59,128.99 152.62,123.97 v152.62,123.53 | v152.62,114.01 152.62,113.09 151.82,112.29 151.82,71.81 v145.5,65.49 | v128.99,40.86 128.99,33.83 U$5.19-A5/SCL0
A6  (via drill 0.35)
  Top 0.508: v129.5,53.68 129.5,53.55 126.86,50.91 126.86,49.44 127.72,48.58 v127.72,40.98
  Bottom 0.508: R13.2 133.06,145.24 | 133.06,145.24 133.3,145.48 Q7.2 | v129.5,53.68 131.22,55.4 131.22,92.64 112.97,110.89 112.97,111.54 124.02,122.59 124.02,149.26 127.44,152.68 135.29,152.68 136.41,151.56 136.41,150.83 133.06,147.48 133.06,145.24 | v127.72,40.98 127.72,34.22 124.2,30.7 124.2,29.48 125.4,28.28 127.03,28.28 U$5.20-A6/TX5/LRCLK1
A7  (via drill 0.35)
  Top 0.508: v157.99,112.69 157.78,112.48 v153.12,112.48 | v145.5,64.22 132.36,51.08 132.36,49.37 130.26,47.28 v130.26,41.36
  Bottom 0.508: R15.2 v157.99,112.69 160.23,114.93 Q8.2 | v153.12,112.48 153.12,110.55 152.48,109.9 152.48,71.2 v145.5,64.22 | v130.26,41.36 130.26,27.92 U$5.21-A7/RX5/BCLK1
A8  (via drill 0.35)
  Top 0.508: v136.49,28.16 137.97,28.16 142.58,32.77 142.58,34.25 144.62,36.28 147.41,36.28 148.17,35.52 148.68,35.52 149.31,36.16 v149.31,45.17
  Bottom 0.508: Q9.2 159.32,55.08 158.2,55.08 | R17.2 158.2,55.08 | v149.31,45.17 152.83,48.69 152.83,50.58 154.54,52.29 155.42,52.29 158.2,55.08 | v136.49,28.16 133.54,25.2 U$5.22-A8/CTX1
A9  (via drill 0.35)
  Top 0.508: v124.55,17.49 130.43,23.37 U$5.23-A9/CRX1/MCLK1
  Bottom 0.508: Q10.2 130.04,18.3 R19.2 125.36,18.3 v124.55,17.49
A10  (via drill 0.35)
  Top 0.508: v133.44,48.35 144.23,37.55 v148.04,37.55
  Bottom 0.508: Q11.2 150.67,38.93 R21.2 147.21,38.39 v148.04,37.55 | U$5.24-A10/TX6/SCL2 125.84,55.95 v133.44,48.35
A11  (via drill 0.35)
  Top 0.508: v112.44,10.84 112.44,15.92 v112.48,15.96 | v125.18,41.36 125.18,47.71 121.16,51.74 U$5.25-A11/RX6/SDA2
  Bottom 0.508: Q12.2 v112.44,10.84 111.09,12.19 R23.2 | v125.18,41.36 125.18,39.14 112.48,26.44 v112.48,15.96
A12  (via drill 0.35)
  Top 0.508: v56.51,10.88 56.86,11.23 v56.86,17.11 | v113.75,36.28 115.95,38.48 115.95,40.4 117.56,42.01 117.56,43.27 v114.77,46.06
  Bottom 0.508: Q13.2 v56.51,10.88 56.51,11.02 R25.2 | v113.75,36.28 90.07,36.28 72.42,18.63 58.38,18.63 v56.86,17.11 | v114.77,46.06 119.4,50.7 U$5.26-A12/MOSI1
A13  (via drill 0.35)
  Top 0.508: v36.69,21.38 38.61,21.38 42.7,17.3 55.4,17.3 v55.59,17.11 | v101.52,45.37 111.34,35.56 v111.34,35.27
  Bottom 0.508: Q14.2 v36.69,21.38 R27.2 | v55.59,17.11 56.37,16.32 57.18,16.32 57.21,16.35 57.37,16.35 58.59,17.57 72.69,17.57 90.39,35.27 v111.34,35.27 | v101.52,45.37 105.93,49.78 107.38,49.78 110.88,53.29 111.04,53.29 117.65,59.9 U$5.27-A13/SCK1
A14  (via drill 0.35)
  Top 0.508: v18,40.35 18,39.21 23.58,33.62 23.58,28.66 36.05,16.2 v55.33,16.2 | v101.94,46.83 101.94,46.21 112.48,35.66 v112.48,35.14
  Bottom 0.508: Q15.2 20.18,36.97 20.18,37.55 | 20.18,37.55 R29.2 | 20.18,37.55 18,39.73 v18,40.35 | v55.33,16.2 55.56,16.2 56.1,15.66 58.22,15.66 59.07,16.51 72.56,16.51 90.54,34.48 111.83,34.48 v112.48,35.14 | v101.94,46.83 106.07,50.96 U$5.38-A14/CS/IN1
A15  (via drill 0.35)
  Top 0.508: v11.16,56.33 16.96,56.33 v17.23,56.6 | v98.51,56.6 106,49.12 U$5.39-A15/CS/OUT1A
  Bottom 0.508: Q16.2 8.99,54.16 v11.16,56.33 R31.2 | v17.23,56.6 17.74,57.11 17.74,67.78 21.81,71.84 62.95,71.84 78.22,56.58 85.58,56.58 85.61,56.6 v98.51,56.6
BVCC  (via drill 0.35)
  Top 0.508: 56.5,50.74 55.77,51.47 | 55.59,51.65 55.57,51.67 Q19.2 | 55.59,51.65 55.59,51.52 55.11,51.52 54.3,50.72 Q19.3 | 51.07,53.25 51.27,53.45 51.27,53.94 | 51.27,54.42 51.27,54.38 | 112.48,119.24 112.48,117.82 | 113.25,118.58 112.48,117.82 | 112.59,117.82 112.48,117.82 | 117.41,114.39 117.31,114.29 117.31,114.39 117.31,114.49 | v46.03,42.36 46.03,46.38 45.11,47.29 | Q20.3 51.27,54.38 | 51.27,54.38 51.27,53.94 | Q20.2 50.52,53.94 51.27,53.94 | Q20.1 50.48,53.15 51.27,53.94 | 55.77,51.47 55.59,51.65 | Q19.1 55.83,51.47 55.77,51.47
  Top 0.61: U$8.12 38,48.12 C12.1 45.11,47.29 51.07,53.25 | U$9.12 48.37,29.74 C9.1 47.29,26.8 v47.33,26.76 | U$7.12 121.22,139.34 C6.1 121.37,140.34 v121.37,141.69 | U$6.12 131.34,121.1 C3.1 120.57,121.79 v120.55,121.82 116.29,117.56 112.48,117.56 111.85,118.2 Q18.1 | Q18.2 112.48,119.26 112.48,119.24 | Q18.3 112.48,117.99 112.48,117.82 | Q17.1 117.35,114.39 117.31,114.39 118.58,113.12 Q17.3 | Q17.2 117.41,114.39
  Top 1: C1.1 47.37,98.9 C16.1
  Top 1.016: U17.5 56.35,102.65 55.68,101.98 | 55.68,101.98 55.48,101.78 50.25,101.78 C16.1 48.98,99.78 | 55.68,101.98 55.68,99.86 C13.1
  Top 2.54: 59.14,57.87 60.41,56.6 PAD26.1 PAD25.1
  Top 3: 59.14,64.18 J1.1 48.98,74.42 48.98,99.78 | 59.14,64.18 59.14,57.87 55.21,53.94 | 51.27,53.94 55.21,53.94 | 55.21,53.94 55.59,53.56 55.59,51.65 | 59.14,64.18 59.14,71.84 101.69,114.39 112.48,114.39 | 117.31,114.39 112.48,114.39 | 112.48,114.39 112.48,117.56 112.48,117.82 113.5,118.83
  Bottom 0.508: 45.99,28.11 45.99,42.32 v46.03,42.36
  Bottom 0.61: v47.33,26.76 45.99,28.11 | v121.37,141.69 121.37,139.98 122.64,138.71 122.64,123.91 v120.55,121.82
CP1  (via drill 0.35)
  Top 0.61: Q17.4 118.15,111.37 v115.97,111.37 | v132.37,121.37 132.37,119.07 U$6.11
  Bottom 0.61: v115.97,111.37 116.45,111.37 126.45,121.37 v132.37,121.37
CP2  (via drill 0.35)
  Top 0.61: U$7.11 121.34,138.34 v121.37,138.37 | v117.97,120.57 117.29,119.89 Q18.4
  Bottom 0.61: v121.37,138.37 121.37,123.97 v117.97,120.57
CP3  (via drill 0.35)
  Top 0.61: U$8.11 37,47.4 v36.97,47.37 | v52.79,56.6 52.63,56.44 Q20.4
  Bottom 0.61: v36.97,47.37 37.31,47.71 45.17,47.71 52.79,55.33 v52.79,56.6
CP4  (via drill 0.35)
  Top 0.61: U$9.11 47.74,30.74 v47.57,30.57 | v50.37,48.37 52.46,50.46 Q19.4
  Bottom 0.61: v47.57,30.57 47.57,45.57 v50.37,48.37
D2  (via drill 0.4)
  Top 0.61: R33.2 R38.1 139.03,124.97 139.7,125.64 142.96,125.64 | 142.96,125.64 143.31,125.64 | 142.96,125.64 143.85,124.75 v143.85,123.91
  Bottom 0.61: v143.85,123.91 143.85,43.9 143.85,43.86 | 143.85,43.86 143.85,33.95 U$5.2-OUT2 | PAD9.1 143.85,43.86
D3  (via drill 0.4)
  Top 0.61: R35.2 134.07,123.62 v134.07,125.18 | v135.34,70.96 141.69,70.96 v141.82,70.83
  Bottom 0.61: v134.07,125.18 135.34,123.91 v135.34,70.96 | v141.82,70.83 141.82,46.44 | 141.82,46.44 141.82,36.07 U$5.3-LRCLK2 | PAD10.1 142.01,46.25 141.82,46.44
D4  (via drill 0.4)
  Top 0.61: R34.2 142.58,124 v142.58,124.68
  Bottom 0.61: v142.58,124.68 142.4,124.5 142.4,123.83 140.42,121.85 140.42,48.98 | 140.42,48.98 U$5.4-BCLK2 | PAD11.1 140.37,48.93 140.42,48.98
D5  (via drill 0.4)
  Top 0.61: R39.2 R44.1 126.45,134.16 v126.45,136.61
  Bottom 0.61: v126.45,136.61 127.33,136.61 130.94,133.01 134.57,133.01 141.64,125.94 141.64,124.14 138.67,121.17 138.67,50.4 | U$5.5-IN2 138.67,48.98 138.67,50.4 | PAD12.1 138.67,50.4
D6  (via drill 0.4)
  Top 0.61: R41.2 v124.93,136.74
  Bottom 0.61: v124.93,136.74 130.26,131.41 134.62,131.41 140.88,125.15 140.88,124.46 136.92,120.5 136.92,54.06 136.92,52.83 | U$5.6-OUT1D 136.92,51.52 | 136.92,51.52 136.92,52.83 | 136.92,51.52 136.97,51.58 PAD13.1 136.92,52.83
D7  (via drill 0.4)
  Top 0.61: R40.2 128.99,123.11 v128.99,122.65 v128.99,122.64
  Bottom 0.61: v128.99,122.65 129.06,122.59 132.64,122.59 133.9,121.33 133.9,70.57 135.17,69.3 135.17,48.98 | U$5.7-RX2/OUT1A 135.17,48.98 | 135.17,50.25 PAD14.1 135.17,48.99 135.17,48.98
D8  (via drill 0.35)
  Top 0.508: R50.1 28.79,41.71 v28.79,40.98
  Top 0.61: R50.1 R45.2
  Bottom 0.508: U$5.8-TX2/IN1 130.76,42.25 121.12,42.25 117.61,38.75 112.48,38.75 90.66,38.75 75.9,23.98 46.2,23.98 29.2,40.98 v28.79,40.98
  Bottom 0.61: PAD15.1 112.07,38.75 112.48,38.75
D9  (via drill 0.35)
  Top 0.508: R47.2 v35.4,44.16 | v103.59,42.07 106.13,39.53 v106.13,37.55
  Bottom 0.508: v106.13,37.55 90.4,37.55 76.15,23.31 45.36,23.31 26.48,42.18 26.48,44.48 26.94,44.94 34.61,44.94 v35.4,44.16 | U$5.9-OUT1C 127.83,42.91 118.46,42.91 115.64,40.09 113.75,40.09 113.05,40.8 109.94,40.8 104.86,40.8 v103.59,42.07
  Bottom 0.61: PAD16.1 109.97,40.77 109.94,40.8
D10  (via drill 0.35)
  Top 0.508: R46.2 v27.27,44.16
  Bottom 0.508: v27.27,44.16 28.64,42.78 28.64,42.47 46.46,24.65 75.64,24.65 95.14,44.16 101.05,44.16 112.53,44.16 113.44,45.07 126.4,45.07 U$5.10-CS\MQSR
  Bottom 0.61: PAD17.1 100.04,44.16 101.05,44.16
D28  (via drill 0.35)
  Top 0.508: R56.1 42.98,37.55 v40.6,37.55 | U$5.28-RX7 119.08,66.48 PAD18.1
  Top 0.61: R56.1 R51.2
  Bottom 0.508: v40.6,37.55 43.25,34.91 43.25,28.8 46.73,25.31 75.25,25.31 101.56,51.62 105.6,51.62 106.04,52.06 106.04,53.44 U$5.28-RX7
D29  (via drill 0.35)
  Top 0.508: R53.2 v44.03,32.35 | U$5.29-TX7 117.41,68.4 PAD19.1
  Bottom 0.508: U$5.29-TX7 104.29,55.28 104.29,54.15 103.6,53.46 102.47,53.46 74.98,25.97 47.01,25.97 45.28,27.71 45.28,31.1 v44.03,32.35
D30  (via drill 0.35)
  Top 0.508: R52.2 48.86,43.74 v48.86,44.79 | U$5.30-CRX3 115.64,70.23 PAD20.1
  Bottom 0.508: U$5.30-CRX3 102.53,57.12 102.53,55.99 101.85,55.3 74.38,55.3 69.07,49.98 60.69,49.98 55.49,44.79 v48.86,44.79
FB  (via drill 0.5)
  Top 1: 59.14,108.67 v59.14,112.48 | v54.06,112.48 54.06,115.02
  Top 1.016: U17.2 58.3,107.83 59.14,108.67
  Top 1.27: R57.1 54.06,115.02 R58.2
  Bottom 1: v59.14,112.48 v54.06,112.48
GND  (via drill 0.35, 1)
  Top 0.508: JP2.1 84.13,80.95 84.67,81.5 84.67,82.62 JP2.3 | v146.77,35.01 v150.58,31.2 | U$5.GND3 113.62,37.69 v113.75,37.55 | v113.75,29.93 121.37,22.31 v121.37,19.51 | PAD23.1 146.29,60.9 146.29,67.09 144.23,69.14 144.23,98.51
  Top 0.61: U$9.28 U$9.27 U$9.26 | U$9.20 U$9.19 U$9.18 | U$8.18 U$8.19 U$8.20 | U$8.26 U$8.27 U$8.28 | U$6.18 U$6.19 U$6.20 | U$6.26 U$6.27 U$6.28 | U$7.28 U$7.27 U$7.26 | U$7.18 U$7.19 U$7.20 | C10.2 43.94,28.66 C9.2 43.9,28.66 42.42,30.15 R56.2 42.11,36.72 40.26,36.72 39.77,37.21 39.77,37.79 35.01,42.55 | R50.2 35.01,42.55 | 35.01,42.55 35.78,42.55 C12.2 | 129.21,139.28 132.89,142.96 134.07,142.96 | C6.2 128.57,139.92 129.21,139.28 | 129.21,139.28 129.21,135.22 R44.2 132.68,126.67 | 132.68,126.67 R38.2 140.68,126.67 C4.2 | C3.2 130.65,124.64 132.68,126.67 | U$5.GND3 106.44,43.6 v98.51,51.52 | v69.3,46.44 70.7,46.44
  Top 1: C1.2 42.42,109 42.63,109.21
  Top 1.016: 62.13,115.23 D1.A | C7.2 30.82,38.86 | R50.2 30.82,42.04 30.82,38.86 | C10.2 30.82,31.62 v30.82,33.74 30.82,38.86 | C14.2 C16.2
  Top 1.27: C15.2 42.63,109.21 C16.2 49.3,109.53 U17.1 57.45,110.2 R58.1 58.72,116.29 D1.A | 70.7,54.06 69.43,52.79 PAD28.1
  Top 1.5: U$8.19 38,69.11 38.82,69.94 | 38.82,69.94 48.35,69.94 v51.52,66.76 | 38.82,69.94 36.28,69.94 | 36.28,69.94 30.57,69.94 | 30.57,69.94 29.93,69.3 29.93,67.93 U$8.27 | 36.28,69.94 36.28,92.76 C1.2 | C8.2 19.01,58.22 | 19.01,58.22 17.23,59.99 17.23,65.49 21.68,69.94 30.57,69.94 | J1.2 70.7,57.71 70.7,54.06 70.7,46.44 70.7,37.55 | 70.7,37.55 70.7,29.17 | 70.7,29.17 68.82,29.17 U$9.19 | 70.7,37.55 68.43,37.55 U$9.27 | C11.2 57.45,18.5 | 57.45,18.5 58.72,17.23 66.76,17.23 70.7,21.17 70.7,29.17 | C10.2 43.94,18.5 57.45,18.5 | C7.2 19.01,42.17 19.01,58.22 | 131.53,98.51 v118.83,98.51 | 131.53,98.51 139.75,98.51 | 139.75,98.51 139.75,100.44 U$6.27 | 131.53,98.51 131.34,98.7 U$6.19 | 139.75,98.51 144.23,98.51 148.04,98.51 151.85,102.32 151.85,109.09 C2.2 150.58,112.9 150.58,126.45 v141.69,135.34 134.07,142.96 132.76,144.27 C17.2 v127.07,151.2 126.41,151.85 v115.02,151.85 113.12,149.95 | 113.12,149.95 111.63,148.46 C5.2 | 113.12,149.95 111.21,151.85 103.59,151.85 98.51,146.77 98.51,139.15 | 99.78,131.34 98.7,131.34 98.51,131.53 98.51,136.61 | 99.78,131.34 U$7.27 | 98.51,139.15 98.51,136.61 | 98.51,139.15 98.7,139.34 U$7.19 | 99.78,131.34 98.51,130.07 v98.51,121.37 | D1.A 62.13,134.52 64.22,136.61 v65.49,136.61 98.51,136.61
  Top 2.54: PAD27.1 PAD28.1
  Top 3: J1.2 67.4,64.22 84.67,81.5
  Bottom 0.508: R26.1 R25.1 55.08,15.23 51.85,18.46 44.55,18.46 R28.1 R27.1 | 30.23,32.77 R30.1 R29.1 21.38,48.1 R32.1 R31.1 | R27.1 30.23,32.77 | R27.1 | 30.23,32.77 30.23,33.15 v30.82,33.74 | R23.1 R24.1 118.99,19.51 v121.37,19.51 R19.1 R20.1 131.94,21.3 133.4,19.85 135.79,19.85 135.95,19.69 U$5.GND6 136.48,19.77 140.6,19.77 U$5.GND1 150.58,29.76 v150.58,31.2 | R22.1 R21.1 146.01,35.78 v146.77,35.01 | R22.1 | R22.1 147.8,48.07 R17.1 R18.1 | R15.1 R16.1 154.81,114.91 146.48,123.24 146.48,126.11 R11.1 R12.1 139.47,133.12 | 139.47,133.12 130.84,141.75 R13.1 R14.1 127.07,146.79 v127.07,151.2 | 139.47,133.12 v141.69,135.34 | R10.1 R9.1 115.02,153.54 v115.02,151.85 | R7.1 R8.1 67.53,135.67 66.98,135.13 | 66.98,135.13 R3.1 R4.1 50.01,124.94 46.44,121.37 46.44,113.75 44.18,111.49 R5.1 R6.1 35.24,109.7 R1.1 R2.1 | 66.98,135.13 v65.49,136.61 | v65.49,136.61 | v113.75,37.55 113.75,37.39 114.54,36.61 114.54,35.96 113.75,35.17 v113.75,29.93
  Bottom 0.61: v98.51,51.52 74.38,51.52 v69.3,46.44 | PAD23.1 PAD24.1 149.06,57.62 R18.1
  Bottom 1.5: v51.52,66.76 61.64,66.76 J1.2 | JP2.1 98.51,80.95 | 98.51,80.95 99.78,80.95 117.35,98.51 v118.83,98.51 | v98.51,121.37 98.51,80.95
M1A  (via drill 0.35)
  Top 0.61: U$6.30 142.34,104.06 140.27,106.13 | U$6.25 137.34,104.73 U$6.HS2 | U$6.1 146.73,119.04 v146.77,119.09
  Top 2.54: PAD1.1 140.27,106.13 U$6.HS2
  Bottom 0.61: v146.77,119.09 146.77,107.4 PAD1.1
M1B  (via drill 0.35)
  Top 0.61: U$6.16 128.34,104.06 130.42,106.13 131.53,106.13 133.34,104.32 U$6.21 | U$6.15 127.88,118.58 v125.69,118.58
  Top 2.54: PAD2.1 130.42,106.13 U$6.HS3
  Bottom 0.61: v125.69,118.58 125.69,109.18 PAD2.1
M2A  (via drill 0.35)
  Top 0.61: U$7.30 104.06,128.34 106.13,130.42 | U$7.25 104.73,133.34 U$7.HS2 | U$7.1 117.56,126.86 v117.56,125.18
  Top 2.54: PAD3.1 106.13,130.42 U$7.HS2
  Bottom 0.61: v117.56,125.18 108.67,125.18 PAD3.1
M2B  (via drill 0.35)
  Top 0.61: U$7.21 104.32,137.34 106.13,139.15 | U$7.16 104.21,142.34 106.13,140.42 | U$7.15 118.83,142.55 v118.83,145.5
  Top 2.54: PAD4.1 106.13,140.42 106.13,139.15 107.4,139.15 107.05,139.51 U$7.HS3
  Bottom 0.61: v118.83,145.5 108.67,145.5 PAD4.1
M3A  (via drill 0.35)
  Top 0.61: U$8.30 27,64.65 U$8.HS2 29.83,61.79 29.93,61.68 32,63.75 U$8.25 | U$8.1 24.26,49.66 v24.22,49.62
  Top 2.54: PAD5.1 21.17,61.81 U$8.HS2
  Bottom 0.61: v24.22,49.62 24.22,58.51 PAD5.1
M3B  (via drill 0.35)
  Top 0.61: U$8.16 41,64.39 38.29,61.68 36,63.98 U$8.21 | U$8.15 41.59,50.25 v43.9,50.25
  Top 2.54: PAD6.1 38.29,61.68 U$8.HS3
  Bottom 0.61: v43.9,50.25 43.9,59.14 PAD6.1
M4A  (via drill 0.35)
  Top 0.61: U$9.30 64.87,40.74 62.19,38.06 U$9.HS2 | U$9.25 63.65,35.74 61.84,37.55 | U$9.1 50.04,43.73 v50,43.78
  Top 2.54: PAD7.1 61.68,37.55 61.84,37.55 U$9.HS2
  Bottom 0.61: v50,43.78 59.02,43.78 PAD7.1
M4B  (via drill 0.35)
  Top 0.61: U$9.16 65.03,26.74 U$9.HS3 64.36,31.74 U$9.21 | U$9.15 50.76,26.03 v50.76,22.19
  Top 2.54: PAD8.1 61.9,29.29 U$9.HS3
  Bottom 0.61: v50.76,22.19 60.66,22.19 PAD8.1
N$1
  Bottom 0.508: LED2.2 50.37,128.88 53.11,126.14 R4.2
N$2
  Bottom 0.508: R6.2 40.03,111.21 36.28,111.21 35.13,112.37 LED3.2
N$3
  Bottom 0.508: LED1.2 18.86,99.43 19.77,98.51 24.89,98.51 R2.2
N$4
  Bottom 0.508: R8.2 65.49,146.48 65.49,149.92 LED4.2
N$5
  Top 0.61: U$6.7 136.34,120.13 R33.1
N$6
  Top 0.61: R34.1 142.08,121.37 141.19,120.49 139.81,120.49 139.34,120.02 U$6.4
N$7
  Top 1: 59.14,102.32 59.14,101.47 C13.2
  Top 1.016: 59.14,102.32 59.14,103.59 58.3,104.43 U17.4
N$8
  Top 0.61: U$6.10 133.34,121.19 R35.1
N$9
  Bottom 0.508: LED5.2 111.21,162.62 R10.2
N$10
  Bottom 0.508: LED6.2 148.39,134.42 145.79,131.82 R12.2
N$11
  Top 0.61: U$6.9 134.34,120.16 R37.1
N$12
  Top 0.61: U$6.5 138.34,120.1 R36.1
N$14
  Top 0.61: U$7.7 120.13,134.34 R39.1
N$15
  Top 0.61: R40.1 120.66,129.75 120.66,130.49 119.8,131.34 U$7.4
N$16
  Top 0.61: U$7.10 121.19,137.34 R41.1
N$17
  Top 0.61: U$7.9 120.16,136.34 R43.1
N$18
  Bottom 0.508: LED7.2 133.46,151.24 130.24,148.02 R14.2
N$19
  Bottom 0.508: LED8.2 162.62,116.29 159.05,116.29 R16.2
N$20
  Bottom 0.508: R18.2 162.88,57.62 LED9.2
N$21
  Bottom 0.508: LED10.2 133.6,17.71 131.21,20.1 R20.2
N$22
  Bottom 0.508: LED11.2 154.22,37.73 151.22,40.73 R22.2
N$23
  Bottom 0.508: LED12.2 116.8,6.97 116.8,9.27 R24.2
N$24
  Bottom 0.508: LED13.2 57.62,6.21 R26.2
N$25
  Bottom 0.508: LED14.2 35.25,15.42 36.92,15.42 39.75,18.26 R28.2
N$26
  Bottom 0.508: LED15.2 17.59,33.74 19.77,33.74 22.31,36.28 22.31,38.29 R30.2
N$27
  Bottom 0.508: LED16.2 7.74,51.52 8.89,51.52 R32.2
N$28
  Top 0.61: U$7.5 120.1,132.34 R42.1
N$30
  Top 0.61: R45.1 33,48.96 U$8.7
N$31
  Top 0.61: R46.1 28.32,48.35 29.43,48.35 29.93,48.86 29.93,49.6 U$8.4
N$32
  Top 0.61: R47.1 36,47.9 U$8.10
N$33
  Top 0.61: R49.1 35,48.93 U$8.9
N$34
  Top 0.61: R48.1 29.55,47.29 31,48.74 U$8.5
N$36
  Top 0.61: R51.1 48.96,34.74 U$9.7
N$37
  Top 0.61: U$9.4 49.18,37.74 48.73,38.19 48.73,39.46 47.71,40.48 R52.1
N$38
  Top 0.61: R53.1 47.9,31.74 U$9.10
N$39
  Top 0.61: R55.1 48.93,32.74 U$9.9
N$40
  Top 0.61: R54.1 48.99,36.74 U$9.5
N$42
  Top 1.016: U17.3.1 U17.3
  Top 2.54: L1.1 68.7,116.45 D1.C 68.86,106.3 U17.3.1
N$203  (via drill 0.35)
  other vias: 63.37,102.37
N$204  (via drill 0.35)
  other vias: 64.57,102.37
N$205  (via drill 0.35)
  other vias: 65.77,102.37
N$206  (via drill 0.35)
  other vias: 66.97,102.37
N$207  (via drill 0.35)
  other vias: 68.17,102.37
N$208  (via drill 0.35)
  other vias: 69.37,102.37
N$209  (via drill 0.35)
  other vias: 63.37,103.64
N$210  (via drill 0.35)
  other vias: 64.57,103.64
N$211  (via drill 0.35)
  other vias: 65.77,103.64
N$212  (via drill 0.35)
  other vias: 66.97,103.64
N$213  (via drill 0.35)
  other vias: 68.17,103.64
N$214  (via drill 0.35)
  other vias: 69.37,103.64
N$215  (via drill 0.35)
  other vias: 63.37,104.91
N$216  (via drill 0.35)
  other vias: 64.57,104.91
N$217  (via drill 0.35)
  other vias: 65.77,104.91
N$218  (via drill 0.35)
  other vias: 66.97,104.91
N$219  (via drill 0.35)
  other vias: 68.17,104.91
N$220  (via drill 0.35)
  other vias: 69.37,104.91
N$221  (via drill 0.35)
  other vias: 63.37,106.18
N$222  (via drill 0.35)
  other vias: 64.57,106.18
N$223  (via drill 0.35)
  other vias: 65.77,106.18
N$224  (via drill 0.35)
  other vias: 66.97,106.18
N$225  (via drill 0.35)
  other vias: 68.17,106.18
N$226  (via drill 0.35)
  other vias: 69.37,106.18
N$227  (via drill 0.35)
  other vias: 63.37,107.45
N$228  (via drill 0.35)
  other vias: 64.57,107.45
N$229  (via drill 0.35)
  other vias: 65.77,107.45
N$230  (via drill 0.35)
  other vias: 66.97,107.45
N$231  (via drill 0.35)
  other vias: 68.17,107.45
N$232  (via drill 0.35)
  other vias: 69.37,107.45
N$233  (via drill 0.35)
  other vias: 63.37,108.72
N$234  (via drill 0.35)
  other vias: 64.57,108.72
N$235  (via drill 0.35)
  other vias: 65.77,108.72
N$236  (via drill 0.35)
  other vias: 66.97,108.72
N$237  (via drill 0.35)
  other vias: 68.17,108.72
N$238  (via drill 0.35)
  other vias: 69.37,108.72
N$239  (via drill 0.35)
  other vias: 63.37,109.99
N$240  (via drill 0.35)
  other vias: 64.57,109.99
N$241  (via drill 0.35)
  other vias: 65.77,109.99
N$242  (via drill 0.35)
  other vias: 66.97,109.99
N$243  (via drill 0.35)
  other vias: 68.17,109.99
N$244  (via drill 0.35)
  other vias: 69.37,109.99
RXD1  (via drill 0.35)
  Top 0.508: v139.15,31.2 130.29,40.07 125.37,40.07 120.5,44.94 120.5,53.37 114.64,59.23 114.64,59.84 88.51,85.97 JP2.7 JP2.8 | v141.69,28.66 145.9,28.66 U$5.0-RX1/CS1/CRX2
  Bottom 0.508: v139.15,31.2 v141.69,28.66
TXD1  (via drill 0.35)
  Top 0.508: JP2.6 JP2.5 112.8,58.08 112.8,57.48 118.83,51.44 118.83,45.17 134.07,29.93 v137.88,29.93 | v139.66,28.28 141.09,29.71 143.12,29.71 145.44,32.04 U$5.1-TX1/MISO1/CTX2
  Bottom 0.508: v137.88,29.93 138.01,29.93 v139.66,28.28
VOUT1
  Top 0.508: 125.25,114.64 125.25,114.68 125.18,114.68 124.56,114.68 | 124.61,113.12 125.25,112.48 125.22,112.45
  Top 0.61: U$6.HS1 135.34,112.48 | 135.34,112.48 U$6.23 | U$6.3 140.34,116.21 136.61,112.48 135.34,112.48 | U$6.13 130.34,116.21 134.07,112.48 135.34,112.48 | Q17.8 124.21,115.66 125.18,114.68 | 125.25,114.64 124.99,114.39 Q17.7 123.49,113.75 Q17.9 | Q17.6 124.61,113.12 | Q17.5 124.61,111.85 125.22,112.45
  Top 1.016: C4.1 148.04,123.95 C2.1 137.46,114.6 135.34,112.48
  Top 2.54: U$6.HS1 134.83,112.48 125.25,112.48 125.25,114.64
VOUT2
  Top 0.508: 111.98,125.95 112.48,126.45 112.87,126.84 113.25,126.45 | 114.52,126.58 114.71,126.77 114.77,126.84 115.09,126.52 115.79,125.82
  Top 0.61: U$7.HS1 112.48,135.34 U$7.23 | U$7.3 116.21,130.34 112.87,133.69 112.87,135.22 112.87,137 116.21,140.34 U$7.13 | Q18.8 111.85,125.82 112.48,126.45 | 113.25,126.45 113.12,126.33 Q18.7 113.75,124.76 Q18.9 | Q18.6 114.39,126.45 114.71,126.77 | Q18.5 115.66,125.95 115.09,126.52
  Top 1.016: 112.48,135.34 113.33,136.19 C5.1 126.49,146.77 C17.1
  Top 2.54: U$7.HS1 112.87,135.22 112.87,126.84 114.77,126.84
VOUT3
  Top 0.508: 43.65,55.71 44.41,56.48 44.45,56.44 Q20.5 | Q20.6 44.2,55.17 43.71,55.65 | Q20.7 44.07,53.9 44.03,53.94 43.71,53.62 44.7,52.63 Q20.8
  Top 0.61: U$8.23 U$8.HS1 33.74,55.71 32.85,55.71 29,51.86 U$8.3 | U$8.13 39,51.73 35.01,55.71 | Q20.9 46.68,53.9 Q20.7
  Top 1.016: 33.74,55.71 31.25,53.21 C8.1 C7.1
  Top 2.54: U$8.HS1 35.01,55.71 43.65,55.71 43.65,55.72 43.71,55.65 43.71,53.62
VOUT4
  Top 0.508: 55.91,43.97 55.57,44.3 Q19.7 | 56.86,44.54 56.84,44.52 | Q19.5 53.73,44.26 54.32,44.26 54.03,43.97 54.19,43.97 54.3,44.08 Q19.6 54.3,46.66 Q19.9 | Q19.8 56.84,44.52 | 56.84,44.52 56.09,43.78
  Top 0.61: U$9.23 U$9.HS1 | U$9.13 52.87,28.74 56.6,32.47 56.6,33.23 56.35,33.49 U$9.HS1 | U$9.3 52.87,38.74 56.09,35.52 U$9.HS1
  Top 1.016: C10.1 46.4,21.04 C11.1 53.21,30.35 56.35,33.49
  Top 2.54: U$9.HS1 56.09,43.78 56.1,43.78 55.91,43.97 54.19,43.97

### Text on the board
tPlace: RX | 5V | TX | GND